# EAGLE design rekickNewGeneration005 (EAGLE 5.10)

## Sheet 1 of 4
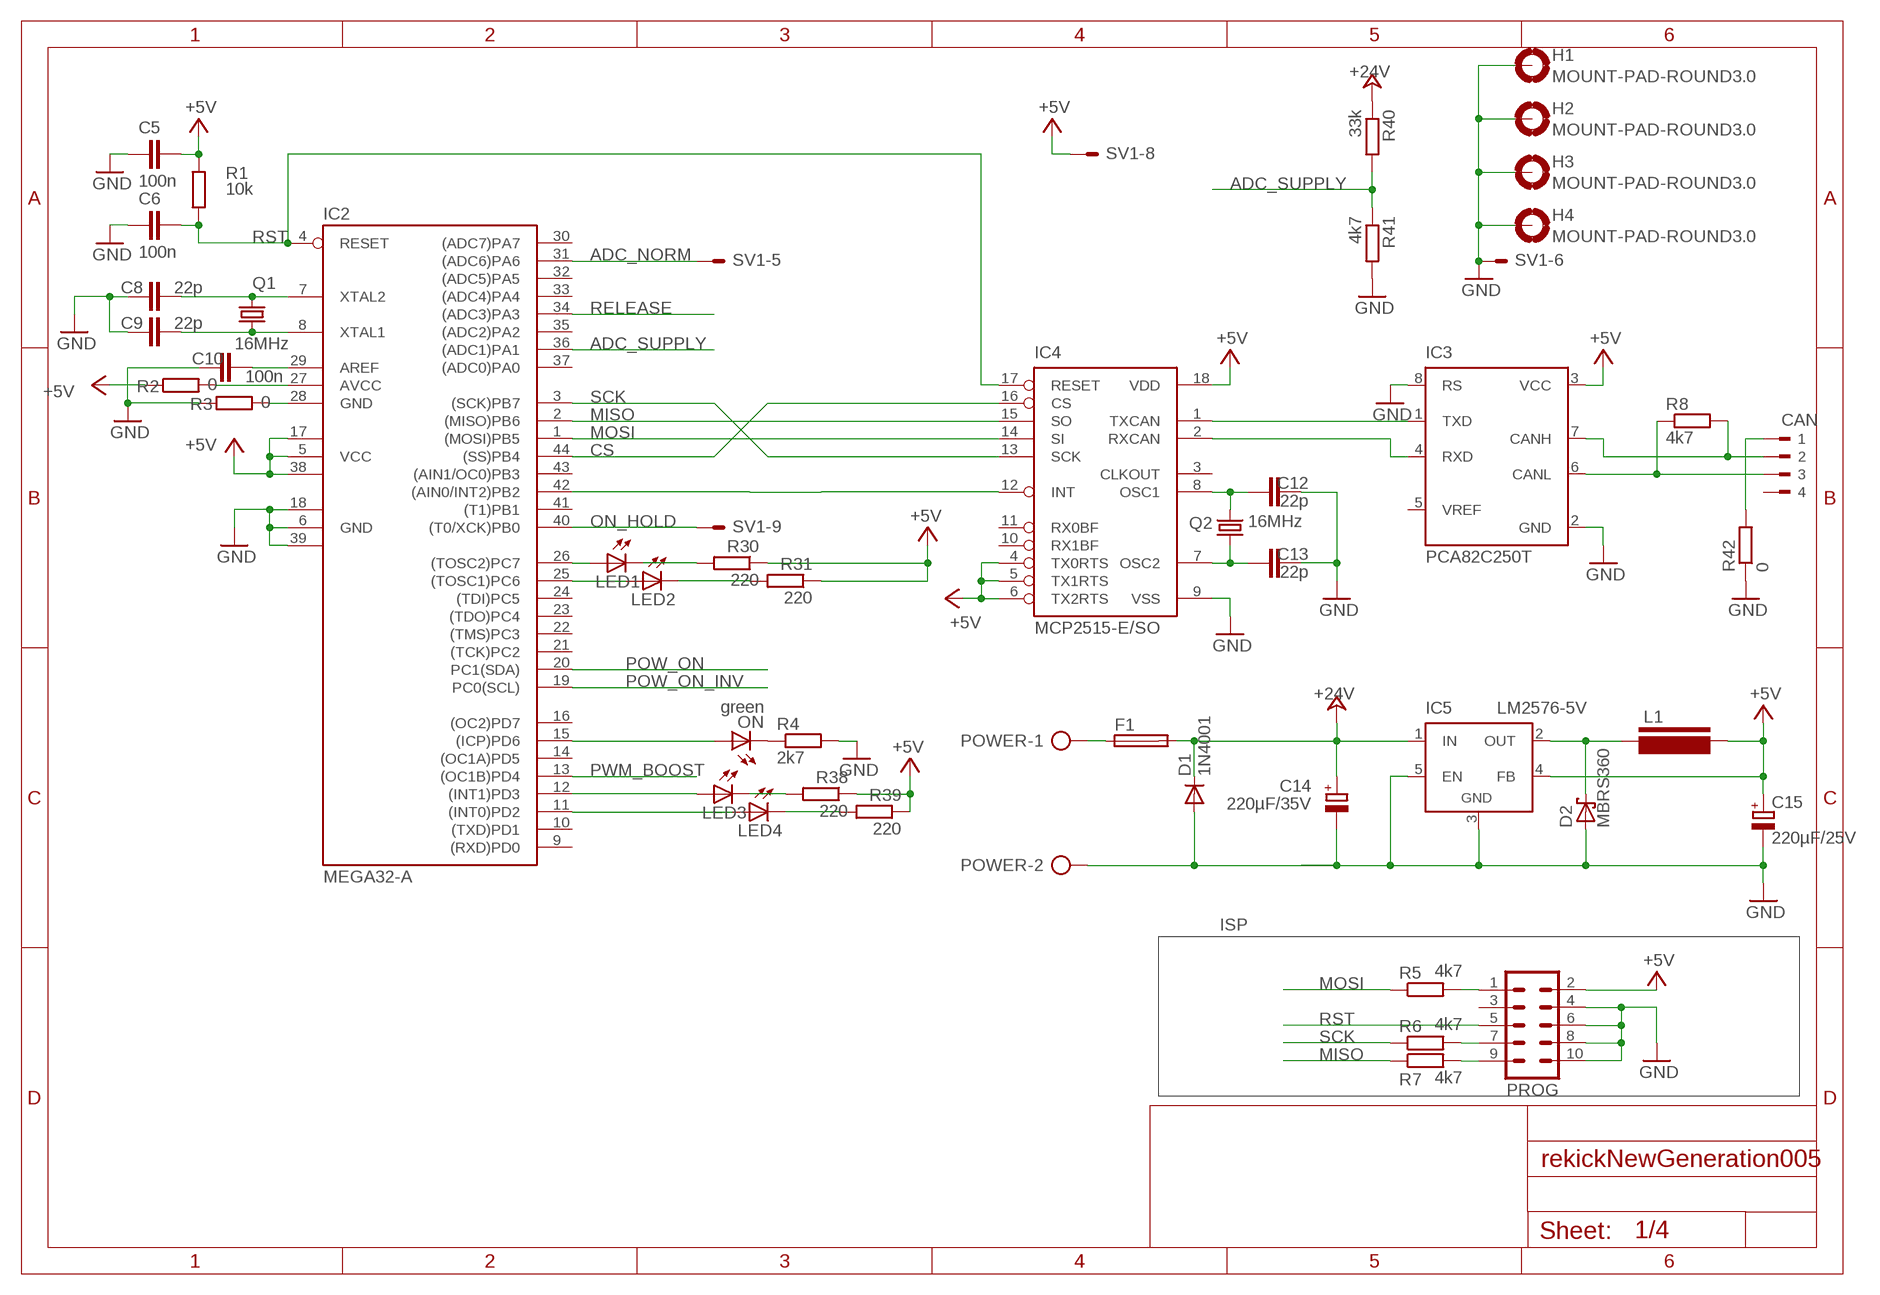
[diagram p0: schematic, sheet 1]

### Parts
C5  100n  C-EUC0603  [C0603]
C6  100n  C-EUC0603  [C0603]
C8  22p  C-EUC0603  [C0603]
C9  22p  C-EUC0603  [C0603]
C10  100n  C-EUC0603  [C0603]
C12  22p  C-EUC0603  [C0603]
C13  22p  C-EUC0603  [C0603]
C14  220µF/35V  CPOL-EUE5-10.5  [E5-10,5]
C15  220µF/25V  CPOL-EUE3.5-10  [E3,5-10]
CAN  90-4  [90-4]
D1  1N4001  1N4004  [DO41-10]
D2  MBRS360  SCHOTTKY-DIODESMC  [SMC]
F1  SH22,5A  [SH22,5A]
H1  MOUNT-PAD-ROUND3.0  [3,0-PAD]
H2  MOUNT-PAD-ROUND3.0  [3,0-PAD]
H3  MOUNT-PAD-ROUND3.0  [3,0-PAD]
H4  MOUNT-PAD-ROUND3.0  [3,0-PAD]
IC2  MEGA32-A  [TQFP44]
IC3  PCA82C250T  [SO8]
IC4  MCP2515-E/SO  [SO18L]
IC5  LM2576-5V  LM2596TV  [TO220-51]
L1  L-PISR  [PISR]
LED1  LEDCHIP-LED0805  [CHIP-LED0805]
LED2  LEDCHIP-LED0805  [CHIP-LED0805]
LED3  LEDCHIP-LED0805  [CHIP-LED0805]
LED4  LEDCHIP-LED0805  [CHIP-LED0805]
ON  green  LED3MM  [LED3MM]
POWER  AK500/2-H  [AK500/2-H]
PROG  ML10  [ML10]
Q1  16MHz  CRYSTALHC49S  [HC49/S]
Q2  16MHz  CRYSTALHC49U-V  [HC49U-V]
R1  10k  R-EU_R0805  [R0805]
R2  0  R-EU_R0805  [R0805]
R3  0  R-EU_R0805  [R0805]
R4  2k7  R-EU_R0805  [R0805]
R5  4k7  R-EU_R0805  [R0805]
R6  4k7  R-EU_R0805  [R0805]
R7  4k7  R-EU_R0805  [R0805]
R8  4k7  R-EU_R0805  [R0805]
R30  220  R-EU_R0805  [R0805]
R31  220  R-EU_R0805  [R0805]
R38  220  R-EU_R0805  [R0805]
R39  220  R-EU_R0805  [R0805]
R40  33k  R-EU_R0805  [R0805]
R41  4k7  R-EU_R0805  [R0805]
R42  0  R-EU_R0805  [R0805]
SV1  ML10E  [ML10]

### Nets
+5V [Power]: C5.2 C15.+ IC2.5(VCC) IC2.17(VCC1) IC2.38(VCC2) IC3.3(VCC) IC4.4(TX0RTS) IC4.5(TX1RTS) IC4.6(TX2RTS) IC4.18(VDD) IC5.4(FB) L1.P$2 PROG.2 R1.2 R2.1 R30.1 R31.1 R38.1 R39.1 SV1.8 ; also sheet 2
+24V [Power]: C14.+ D1.C F1.2 IC5.1(IN) R40.1 ; also sheet 2
ADC_NORM: IC2.31((ADC6)PA6) SV1.5
ADC_SUPPLY: IC2.36((ADC1)PA1) R40.2 R41.1
CS: IC2.44((SS)PB4) IC4.16(CS)
GND [Power]: C5.1 C6.1 C8.1 C9.2 C10.1 C12.2 C13.2 C14.- C15.- D1.A D2.A H1.B3,0(MOUNT) H2.B3,0(MOUNT) H3.B3,0(MOUNT) H4.B3,0(MOUNT) IC2.6(GND) IC2.18(GND1) IC2.39(GND2) IC3.2(GND) IC3.8(RS) IC4.9(VSS) IC5.3(GND) IC5.5(EN) POWER.2 PROG.4 PROG.6 PROG.8 PROG.10 R3.1 R4.2 R41.2 R42.1 SV1.6 ; also sheet 2
MISO: IC2.2((MISO)PB6) IC4.15(SO) R7.1
MOSI: IC2.1((MOSI)PB5) IC4.14(SI) R5.1
N$1: IC2.15((ICP)PD6) ON.A
N$2: C10.2 IC2.29(AREF)
N$3: IC2.27(AVCC) R2.2
N$4: C9.1 IC2.8(XTAL1) Q1.1
N$5: C8.2 IC2.7(XTAL2) Q1.2
N$6: PROG.1 R5.2
N$7: IC2.28(GND) R3.2
N$8: PROG.7 R6.2
N$9: PROG.9 R7.2
N$22: IC3.4(RXD) IC4.2(RXCAN)
N$24: CAN.3 IC3.6(CANL) R8.1
N$30 [Power]: D2.C IC5.2(OUT) L1.P$1
N$31: ON.K(C) R4.1
N$42: IC2.42((AIN0/INT2)PB2) IC4.12(INT)
N$43 [Power]: F1.1 POWER.1
N$44: LED2.C R31.2
N$45: LED1.C R30.2
N$46: CAN.1 R42.2
N$48: IC2.26((TOSC2)PC7) LED1.A
N$49: IC2.25((TOSC1)PC6) LED2.A
N$53: C13.1 IC4.7(OSC2) Q2.1
N$54: C12.1 IC4.8(OSC1) Q2.2
N$58: LED3.C R38.2
N$59: CAN.2 IC3.7(CANH) R8.2
N$60: LED4.C R39.2
N$61: IC2.12((INT1)PD3) LED3.A
N$62: IC2.11((INT0)PD2) LED4.A
ON_HOLD: IC2.40((T0/XCK)PB0) SV1.9
PIN1: IC3.1(TXD) IC4.1(TXCAN)
POW_ON: IC2.20(PC1(SDA)) ; also sheet 2
POW_ON_INV: IC2.19(PC0(SCL)) ; also sheet 2
PWM_BOOST: IC2.13((OC1B)PD4) ; also sheet 2
RELEASE: IC2.34((ADC3)PA3) ; also sheet 2
RST: C6.2 IC2.4(RESET) IC4.17(RESET) PROG.5 R1.1 ; also sheet 2
SCK: IC2.3((SCK)PB7) IC4.13(SCK) R6.1
Unconnected: CAN.4 IC2.9((RXD)PD0) IC2.10((TXD)PD1) IC2.14((OC1A)PD5) IC2.16((OC2)PD7) IC2.21((TCK)PC2) IC2.22((TMS)PC3) IC2.23((TDO)PC4) IC2.24((TDI)PC5) IC2.30((ADC7)PA7) IC2.32((ADC5)PA5) IC2.33((ADC4)PA4) IC2.35((ADC2)PA2) IC2.37((ADC0)PA0) IC2.41((T1)PB1) IC2.43((AIN1/OC0)PB3) IC3.5(VREF) IC4.3(CLKOUT) IC4.10(RX1BF) IC4.11(RX0BF) PROG.3 SV1.3 SV1.10

### Notes on the sheet
- ISP

## Sheet 2 of 4
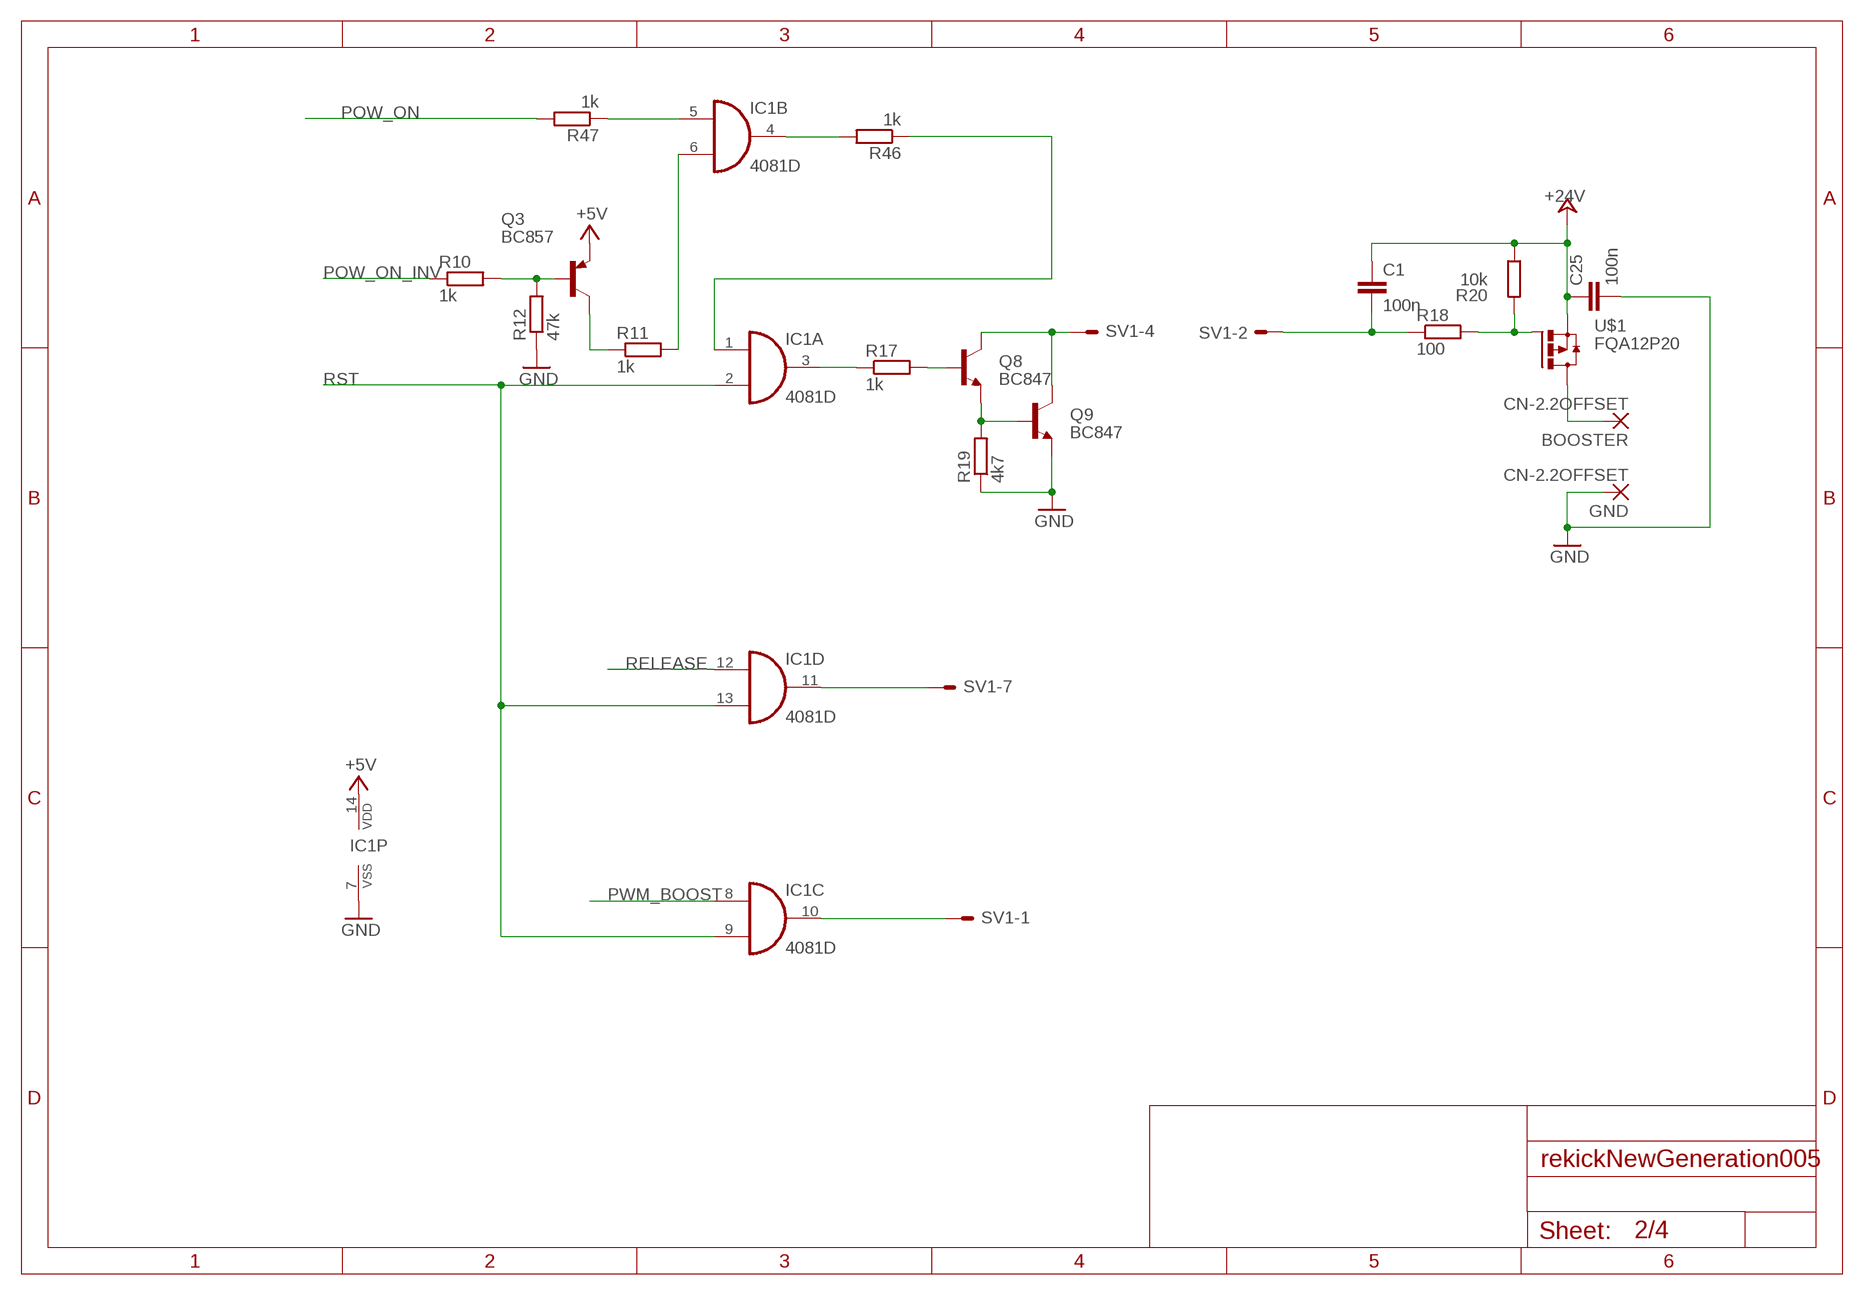
[diagram p1: schematic, sheet 2]

### Parts
BOOSTER  CN-2.2OFFSET  [CN-2,1]
C1  100n  C-EUC0603  [C0603]
C25  100n  C-EUC0603  [C0603]
GND  CN-2.2OFFSET  [CN-2,1]
IC1  4081D  [SO14]
Q3  BC857  BC857ASMD  [SOT23-BEC]
Q8  BC847  BC817-25SMD  [SOT23-BEC]
Q9  BC847  BC817-25SMD  [SOT23-BEC]
R10  1k  R-EU_R0805  [R0805]
R11  1k  R-EU_R0805  [R0805]
R12  47k  R-EU_R0805  [R0805]
R17  1k  R-EU_R0805  [R0805]
R18  100  R-EU_R0805  [R0805]
R19  4k7  R-EU_R0805  [R0805]
R20  10k  R-EU_R0805  [R0805]
R46  1k  R-EU_R0805  [R0805]
R47  1k  R-EU_R0805  [R0805]
U$1  FQA12P20  [TO247BV]

### Nets
+5V [Power]: IC1.14(P:VDD) Q3.E ; also sheet 1
+24V [Power]: C1.1 C25.1 R20.1 U$1.S ; also sheet 1
GND [Power]: C25.2 GND.>NAME(P) IC1.7(P:VSS) Q9.E R12.1 R19.1 ; also sheet 1
N$10 [Power]: Q8.C Q9.C SV1.4
N$13: Q8.E Q9.B R19.2
N$20: C1.2 R18.1 SV1.2
N$21: Q8.B R17.2
N$26: R18.2 R20.2 U$1.G
N$28: Q3.B R10.2 R12.2
N$29: IC1.11(D:O) SV1.7
N$32: Q3.C R11.1
N$33: IC1.6(B:I1) R11.2
N$36: IC1.10(C:O) SV1.1
N$40: IC1.3(A:O) R17.1
N$41: BOOSTER.>NAME(P) U$1.D
N$50: IC1.4(B:O) R46.2
N$65: IC1.1(A:I0) R46.1
N$67: IC1.5(B:I0) R47.1
POW_ON: R47.2 ; also sheet 1
POW_ON_INV: R10.1 ; also sheet 1
PWM_BOOST: IC1.8(C:I0) ; also sheet 1
RELEASE: IC1.12(D:I0) ; also sheet 1
RST: IC1.2(A:I1) IC1.9(C:I1) IC1.13(D:I1) ; also sheet 1

## Sheet 3 of 4
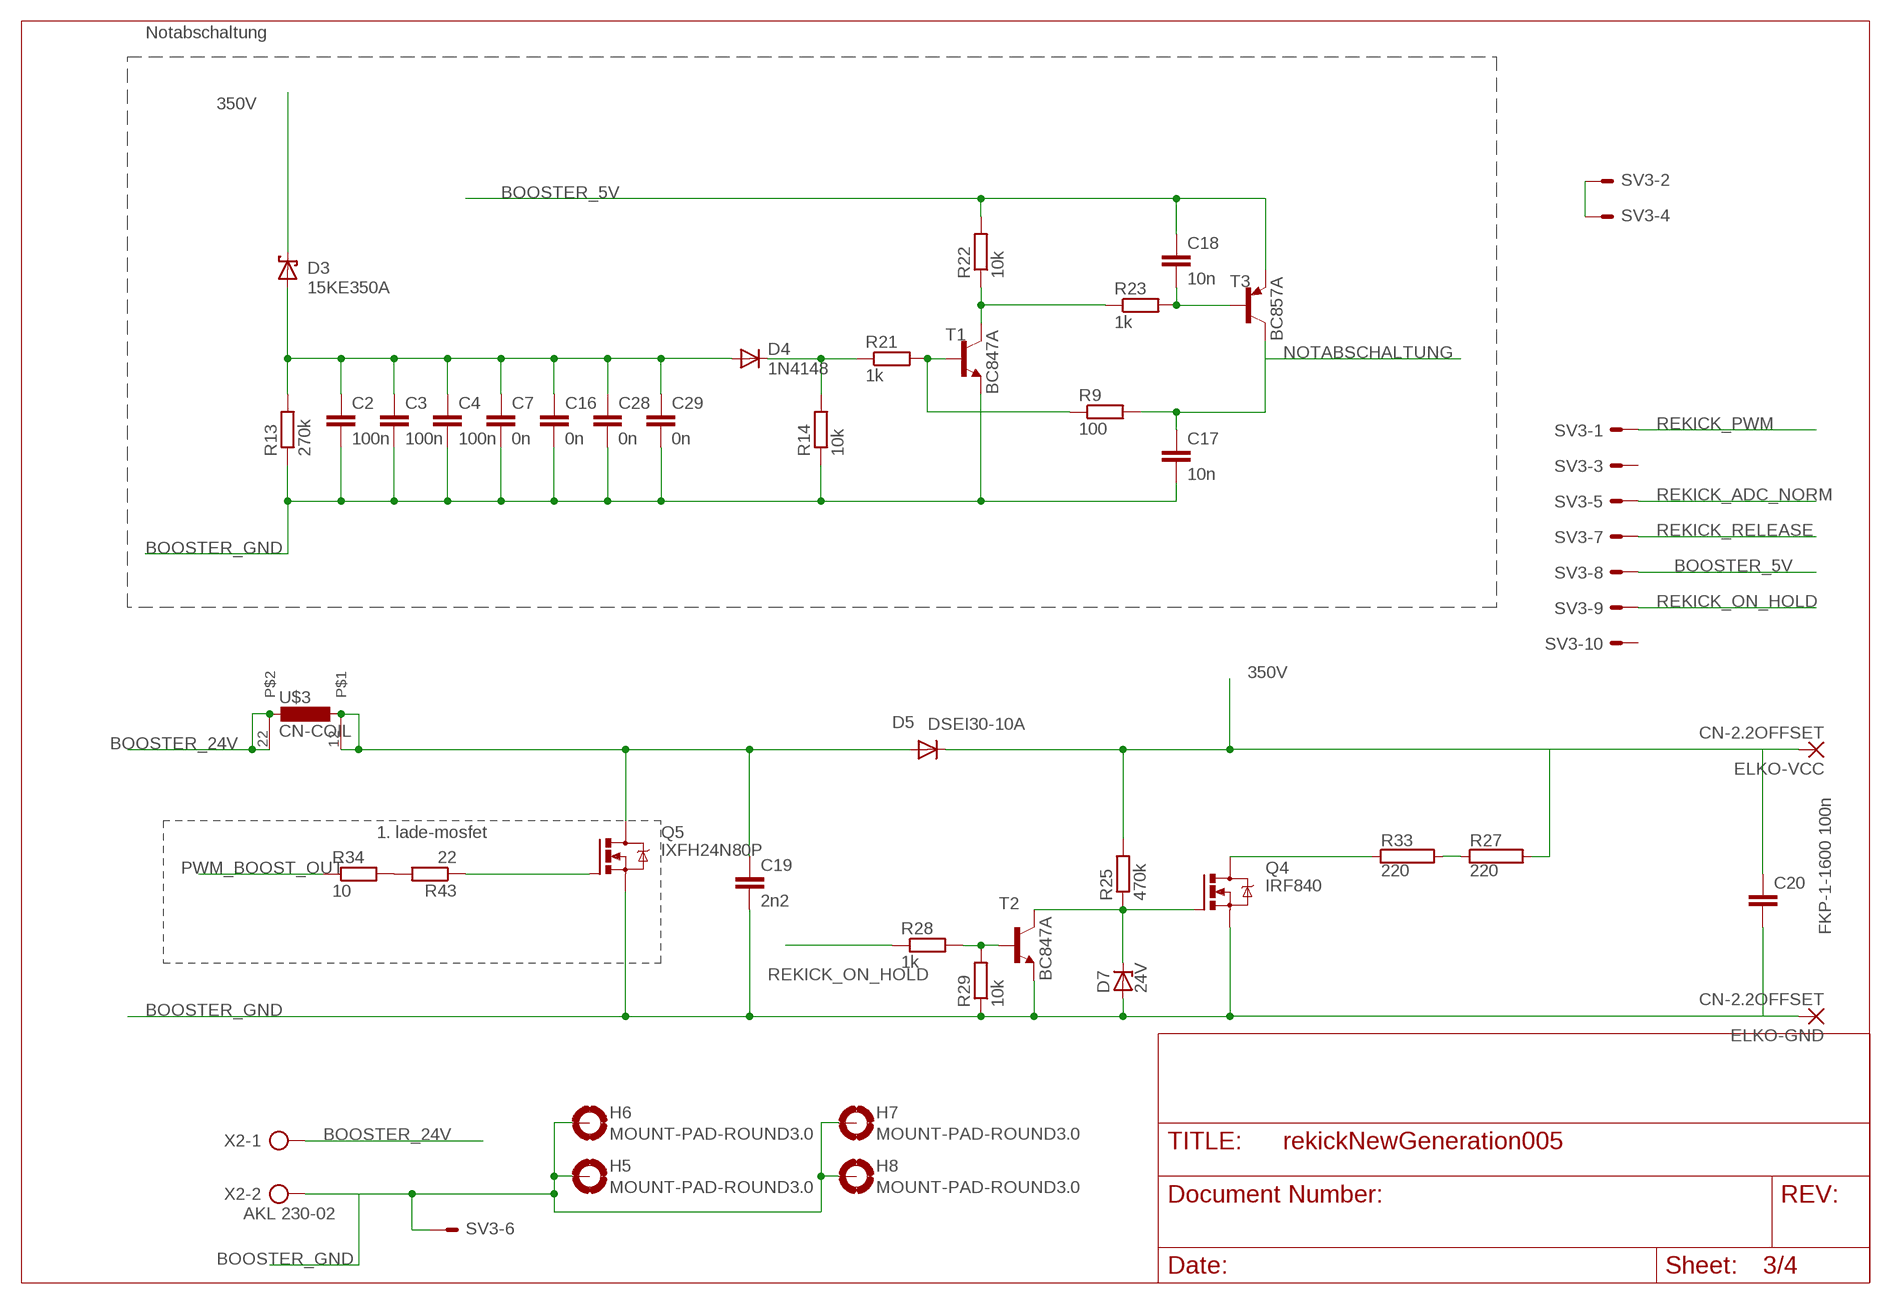
[diagram p2: schematic, sheet 3]

### Parts
C2  100n  C-EUC0603  [C0603]
C3  100n  C-EUC0603  [C0603]
C4  100n  C-EUC0603  [C0603]
C7  0n  C-EUC0603  [C0603]
C16  0n  C-EUC0603  [C0603]
C17  10n  C-EUC0603  [C0603]
C18  10n  C-EUC0603  [C0603]
C19  2n2  C-EU150-054X183  [C150-054X183]
C20  FKP-1-1600 100n  C-EU375-192X418  [C375-192X418]
C28  0n  C-EUC0603  [C0603]
C29  0n  C-EUC0603  [C0603]
D3  15KE350A  15KEXX  [CB429-17]
D4  1N4148  [DO35-10]
D5  DSEI30-10A  DEIS10-30A  [TO247AD]
D7  24V  ZENER-DIODEDO35Z10  [DO35Z10]
ELKO-GND  CN-2.2OFFSET  [CN-2,1]
ELKO-VCC  CN-2.2OFFSET  [CN-2,1]
H5  MOUNT-PAD-ROUND3.0  [3,0-PAD]
H6  MOUNT-PAD-ROUND3.0  [3,0-PAD]
H7  MOUNT-PAD-ROUND3.0  [3,0-PAD]
H8  MOUNT-PAD-ROUND3.0  [3,0-PAD]
Q4  IRF840  IRF740  [TO220BV]
Q5  IXFH24N80P  IRFPC40  [TO247BV]
R9  100  R-EU_R0805  [R0805]
R13  270k  R-EU_R0805  [R0805]
R14  10k  R-EU_R0805  [R0805]
R21  1k  R-EU_R0805  [R0805]
R22  10k  R-EU_R0805  [R0805]
R23  1k  R-EU_R0805  [R0805]
R25  470k  R-EU_R0805  [R0805]
R27  220  RHS25  [HS25]
R28  1k  R-EU_R0805  [R0805]
R29  10k  R-EU_R0805  [R0805]
R33  220  RHS25  [HS25]
R34  10  R-EU_R0805  [R0805]
R43  22  R-EU_R0805  [R0805]
SV3  ML10E  [ML10]
T1  BC847A  BC817-25-NPN-SOT23-BEC  [SOT23-BEC]
T2  BC847A  BC817-25-NPN-SOT23-BEC  [SOT23-BEC]
T3  BC857A  BC807-25-PNP-SOT23-BEC  [SOT23-BEC]
U$3  CN-COIL  [CN-TJ6-U1-2]
X2  AKL 230-02  AK500/2  [AK500/2]

### Nets
350V: C20.1 D3.C D5.K(C) ELKO-VCC.>NAME(P) R25.2 R27.2 ; also sheet 4
BOOSTER_5V: C18.1 R22.2 SV3.8 T3.E
BOOSTER_24V [Power]: U$3.21 U$3.22 X2.1 ; also sheet 4
BOOSTER_GND [Power]: C2.2 C3.2 C4.2 C7.2 C16.2 C17.2 C19.2 C20.2 C28.2 C29.2 D7.A ELKO-GND.>NAME(P) H5.B3,0(MOUNT) H6.B3,0(MOUNT) H7.B3,0(MOUNT) H8.B3,0(MOUNT) Q4.S Q5.S R13.1 R14.1 R29.1 SV3.6 T1.E T2.E X2.2 ; also sheet 4
N$15: C2.1 C3.1 C4.1 C7.1 C16.1 C28.1 C29.1 D3.A D4.A R13.2
N$27: C18.2 R23.2 T3.B
N$34: R9.1 R21.2 T1.B
N$35 [Power]: C19.1 D5.A Q5.D U$3.11 U$3.12
N$37: D7.C Q4.G R25.1 T2.C
N$38: R28.2 R29.2 T2.B
N$47: R34.2 R43.2
N$51: Q5.G R43.1
N$52: D4.C R14.2 R21.1
N$56: Q4.D R33.1
N$57: R27.1 R33.2
N$66: SV3.2 SV3.4
N$101: R22.1 R23.1 T1.C
NOTABSCHALTUNG: C17.1 R9.2 T3.C ; also sheet 4
PWM_BOOST_OUT: R34.1 ; also sheet 4
REKICK_ADC_NORM: SV3.5 ; also sheet 4
REKICK_ON_HOLD: R28.1 SV3.9
REKICK_PWM: SV3.1 ; also sheet 4
REKICK_RELEASE: SV3.7 ; also sheet 4
Unconnected: SV3.3 SV3.10

### Notes on the sheet
- Notabschaltung
- 1. lade-mosfet

## Sheet 4 of 4
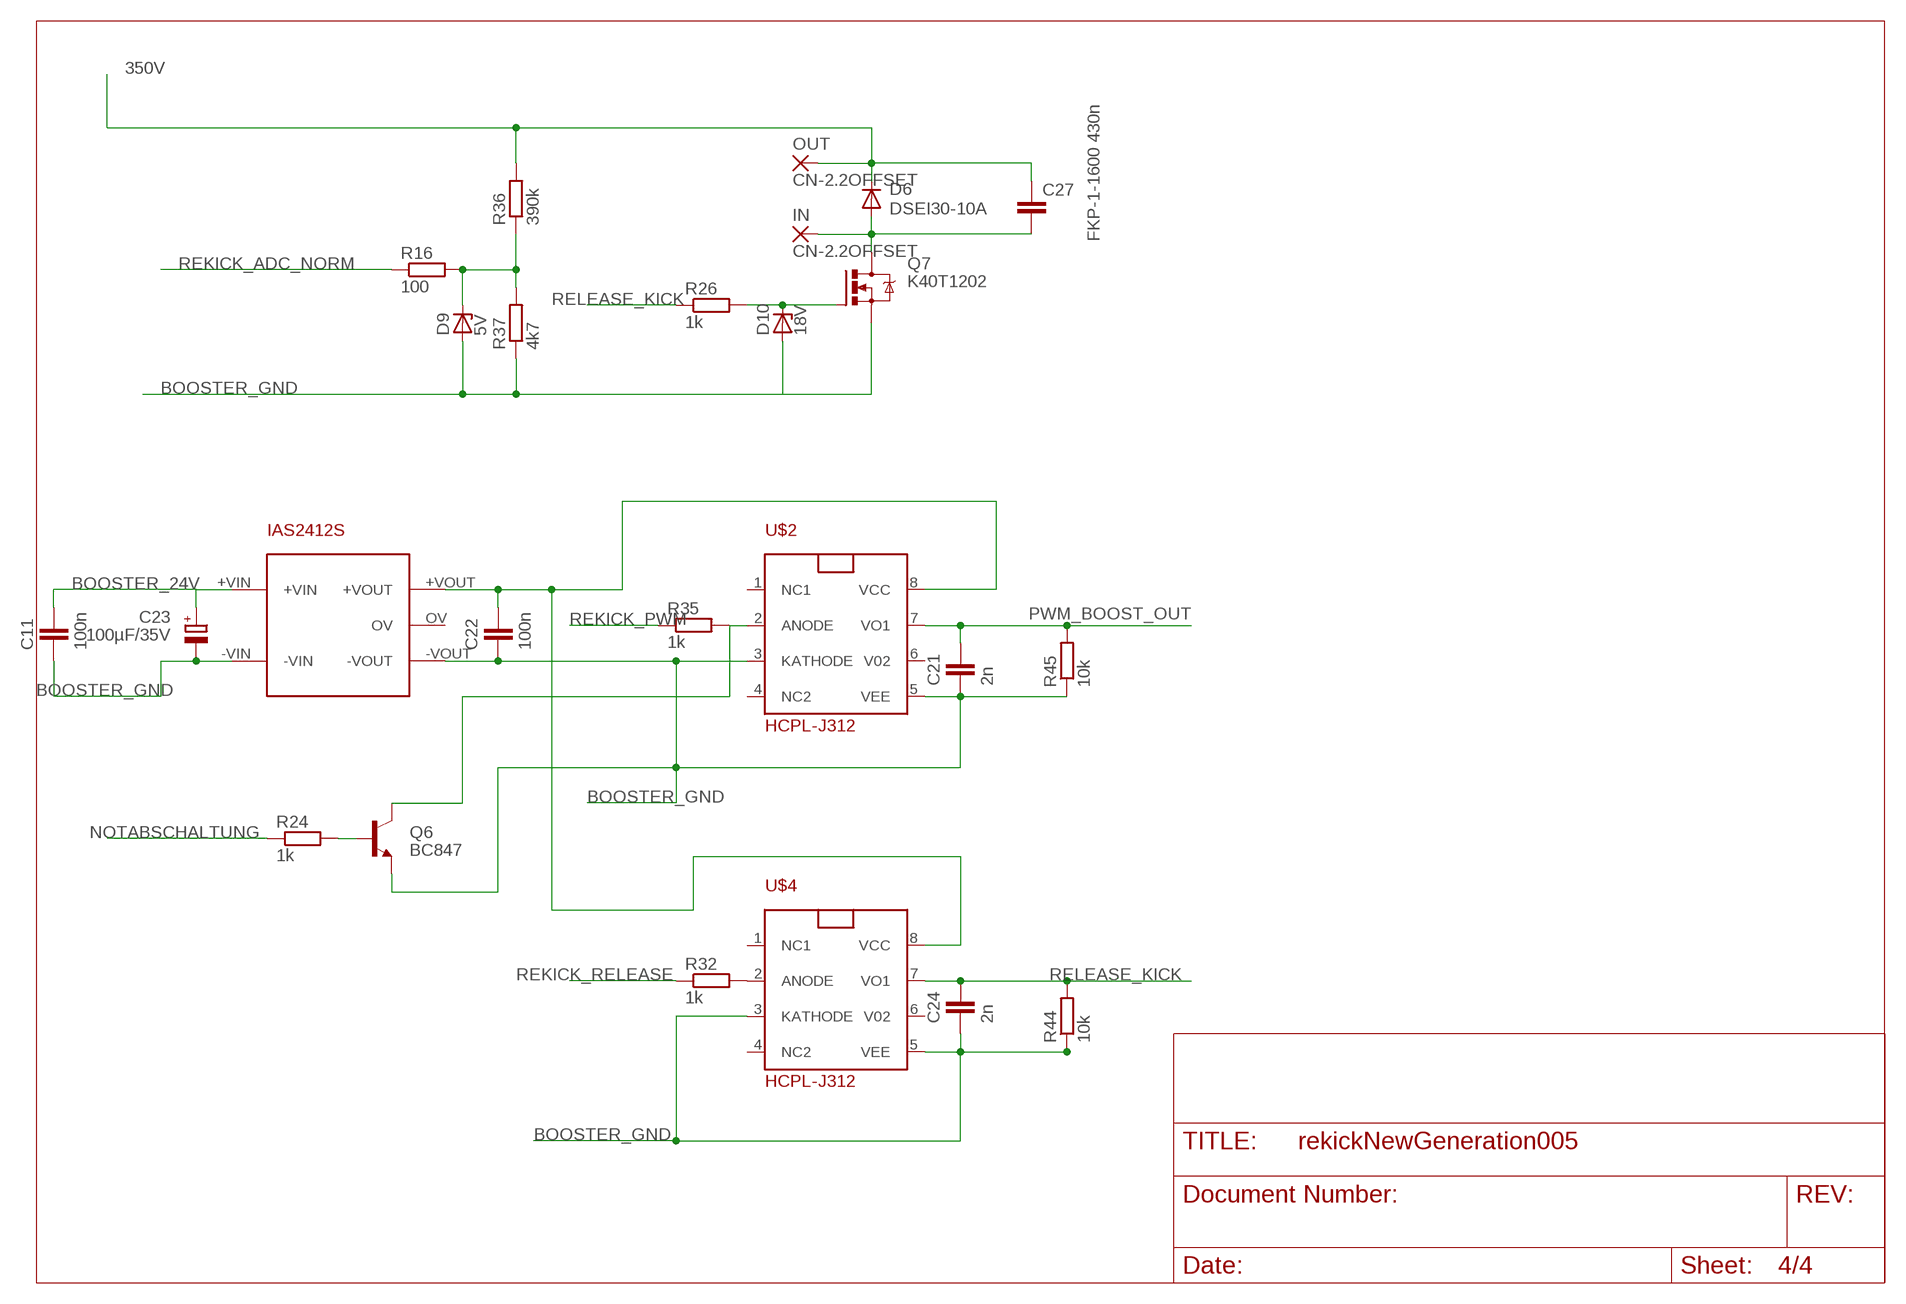
[diagram p3: schematic, sheet 4]

### Parts
C11  100n  C-EUC0603  [C0603]
C21  2n  C-EUC0603  [C0603]
C22  100n  C-EUC0603  [C0603]
C23  100µF/35V  CPOL-EUE5-10.5  [E5-10,5]
C24  2n  C-EUC0603  [C0603]
C27  FKP-1-1600 430n  C-EU375-192X418  [C375-192X418]
D6  DSEI30-10A  DEIS10-30A  [TO247AD]
D9  5V  ZENER-DIODESOT23  [SOT23]
D10  18V  ZENER-DIODEDO35Z10  [DO35Z10]
IN  CN-2.2OFFSET  [CN-2,1]
OUT  CN-2.2OFFSET  [CN-2,1]
Q6  BC847  BC817-25SMD  [SOT23-BEC]
Q7  K40T1202  IRFPC40  [TO247BV]
R16  100  R-EU_R0805  [R0805]
R24  1k  R-EU_R0805  [R0805]
R26  1k  R-EU_R0805  [R0805]
R32  1k  R-EU_R0805  [R0805]
R35  1k  R-EU_R0805  [R0805]
R36  390k  R-EU_0207/15  [0207/15]
R37  4k7  R-EU_0207/15  [0207/15]
R44  10k  R-EU_R0805  [R0805]
R45  10k  R-EU_R0805  [R0805]
U$2  HCPL-J312  [DIL08]
U$4  HCPL-J312  [DIL08]
U$5  IA2412S  [SIP]

### Nets
350V: C27.1 D6.K(C) OUT.>NAME(P) R36.2 ; also sheet 3
ADC_250V1: D9.3(C) R16.2 R36.1 R37.2
BOOSTER_24V [Power]: C11.2 C23.+ U$5.+VIN ; also sheet 3
BOOSTER_GND [Power]: C11.1 C21.1 C22.1 C23.- C24.1 D9.1(A) D10.A Q6.E Q7.S R37.1 R44.1 R45.1 U$2.3(KATHODE) U$2.5(VEE) U$4.3(KATHODE) U$4.5(VEE) U$5.-VIN U$5.-VOUT ; also sheet 3
BOSTER_24V: C27.2 D6.A IN.>NAME(P) Q7.D
N$55: D10.C Q7.G R26.2
N$68: R32.2 U$4.2(ANODE)
N$69 [Power]: Q6.C R35.2 U$2.2(ANODE)
N$70: C22.2 U$2.8(VCC) U$4.8(VCC) U$5.+VOUT
N$73: Q6.B R24.2
NOTABSCHALTUNG: R24.1 ; also sheet 3
PWM_BOOST_OUT: C21.2 R45.2 U$2.7(VO1) ; also sheet 3
REKICK_ADC_NORM: R16.1 ; also sheet 3
REKICK_PWM: R35.1 ; also sheet 3
REKICK_RELEASE: R32.1 ; also sheet 3
RELEASE_KICK: C24.2 R26.1 R44.2 U$4.7(VO1)
Unconnected: U$2.1(NC1) U$2.4(NC2) U$2.6(V02) U$4.1(NC1) U$4.4(NC2) U$4.6(V02) U$5.OV

## Library data of the parts
BOOSTER ELKO-GND ELKO-VCC GND IN OUT = mywirepad:CN-2.2OFFSET
C1-C13 C16-C22 C24 C25 C27-C29 = rcl:C-EU: CAPACITOR, European symbol
C14 C15 C23 = rcl:CPOL-EU: POLARIZED CAPACITOR, European symbol
CAN = con-weidmueller-sl35:90-4: WEIDMUELLER CLAMP CONNECTOR
D1 = diode:1N4004: DIODE general purpose rectifier, 1 A
D2 = diode:SCHOTTKY-DIODE: Schottky Diode
D3 = diode:15KEXX: DIODE
D4 = diode:1N4148: DIODE high speed (Philips)
D5 D6 = carpenoctem:DEIS10-30A
D7 D9 D10 = diode:ZENER-DIODE: Z-Diode
F1 = fuse:SH22,5A: FUSE HOLDER grid 22,5mm, isolated cap OGN0031 8201, Schurter (Buerklin)
H1-H8 = holes:MOUNT-PAD-ROUND: MOUNTING PAD, round
IC1 = 40xx:4081: Quad 2-input AND
IC2 = atmel:MEGA32: MICROCONTROLLER 32 Kbytes FLASH 2 Kbytes SRAM 1 Kbytes EEPROM USART 8-channel 10 bit ADC Source: www.atmel.com .. doc2503.pdf
IC3 = micro-philips:PCA82C250: CAN CONTROLLER INTERFACE
IC4 = mcp2515:MCP2515
IC5 = linear:LM2596T: STEP-DOWN VOLTAGE REGULATOR
L1 = L-PISR:L-PISR: Fastron SMD Power Inductors (also Shielded) - PISR Series Data Sheet <http://www.fastrongroup.com/products/inductors/pdf/PISR.pdf> Part No Inductance L (µH) fL (MHz) Tol ± (%) SRF min (MHz) DCR max (Ω) Rated DC Current | sat (A) | Δ T = 40°C (A) PISR-1R0M-04 1.0 0.1 20 164 0.009 21 8.60 PISR-2R2M-04 2.2 0.1 20 95 0.014 16 7.10 PISR-3R3M-04 3.3 0.1 20 72 0.017 15 6.40 PISR-4R7M-04 4.7 0.1 20 52 0.019 13 5.80 PISR-5R6M-04 5.6 0.1 20 41 0.022 12 5.50 PISR-6R8M-04 6.8 0.1 20 35 0.024 11 5.20 PISR-100M-04 10 0.1 20 24 0.029 10 4.50 PISR-150M-04 15 0.1 20 20 0.035 8.0 4.10 PISR-220M-04 22 0.1 20 15 0.04 7.0 3.60 PISR-330M-04 33 0.1 20 10 0.06 5.6 3.10 PISR-470M-04 47 0.1 20 8 0.07 4.6 2.70 PISR-680M-04 68 0.1 20 6.5 0.10 3.6 2.30 PISR-101M-04 100 0.1 20 5.2 0.17 3.1 1.90 PISR-151M-04 150 0.1 20 4.2 0.22 2.6 1.60 PISR-221M-04 220 0.1 20 3.3 0.34 2.2 1.30 PISR-331M-04 330 0.1 20 2.7 0.52 1.9 1.10 PISR-471M-04 470 0.1 20 2.1 0.76 1.4 0.85 PISR-681M-04 680 0.1 20 1.8 1.1 1.2 0.74 PISR-102M-04 1000 0.1 20 1.3 1.7 1.0 0.57
LED1-LED4 ON = led:LED: LED OSRAM: - CHIPLED LG R971, LG N971, LY N971, LG Q971, LY Q971, LO R971, LY R971 LH N974, LH R974 LS Q976, LO Q976, LY Q976 LO Q996 - Hyper CHIPLED LW Q18S LB Q993, LB Q99A, LB R99A - SideLED LS A670, LO A670, LY A670, LG A670, LP A670 LB A673, LV A673, LT A673, LW A673 LH A674 LY A675 LS A676, LA A676, LO A676, LY A676, LW A676 LS A679, LY A679, LG A679 - Hyper Micro SIDELED® LS Y876, LA Y876, LO Y876, LY Y876 LT Y87S - SmartLED LW L88C, LW L88S LB L89C, LB L89S, LG L890 LS L89K, LO L89K, LY L89K LS L896, LA L896, LO L896, LY L896 - TOPLED LS T670, LO T670, LY T670, LG T670, LP T670 LSG T670, LSP T670, LSY T670, LOP T670, LYG T670 LG T671, LOG T671, LSG T671 LB T673, LV T673, LT T673, LW T673 LH T674 LS T676, LA T676, LO T676, LY T676, LB T676, LH T676, LSB T676, LW T676 LB T67C, LV T67C, LT T67C, LS T67K, LO T67K, LY T67K, LW E67C LS E67B, LA E67B, LO E67B, LY E67B, LB E67C, LV E67C, LT E67C LW T67C LS T679, LY T679, LG T679 LS T770, LO T770, LY T770, LG T770, LP T770 LB T773, LV T773, LT T773, LW T773 LH T774 LS E675, LA E675, LY E675, LS T675 LS T776, LA T776, LO T776, LY T776, LB T776 LHGB T686 LT T68C, LB T68C - Hyper Mini TOPLED® LB M676 - Mini TOPLED Santana® LG M470 LS M47K, LO M47K, LY M47K Source: http://www.osram.convergy.de LUXEON: - LUMILED® LXK2-PW12-R00, LXK2-PW12-S00, LXK2-PW14-U00, LXK2-PW14-V00 LXK2-PM12-R00, LXK2-PM12-S00, LXK2-PM14-U00 LXK2-PE12-Q00, LXK2-PE12-R00, LXK2-PE12-S00, LXK2-PE14-T00, LXK2-PE14-U00 LXK2-PB12-K00, LXK2-PB12-L00, LXK2-PB12-M00, LXK2-PB14-N00, LXK2-PB14-P00, LXK2-PB14-Q00 LXK2-PR12-L00, LXK2-PR12-M00, LXK2-PR14-Q00, LXK2-PR14-R00 LXK2-PD12-Q00, LXK2-PD12-R00, LXK2-PD12-S00 LXK2-PH12-R00, LXK2-PH12-S00 LXK2-PL12-P00, LXK2-PL12-Q00, LXK2-PL12-R00 Source: www.luxeon.com KINGBRIGHT: KA-3528ASYC Source: www.kingbright.com
POWER = con-ptr500:AK500/2-H: CONNECTOR Aug. 2004 / PTR Meßtechnik: Die Bezeichnung der Serie AK505 wurde geändert. Es handelt sich hierbei um AK500 in horizontaler Ausführung.
PROG = con-harting-ml:ML10: HARTING
Q1 Q2 = crystal:CRYSTAL: CRYSTAL
Q3 = transistor-pnp:BC857*: PNP Transistror
Q4 = transistor-power:IRF740: N-CHANNEL MOS FET
Q5 Q7 = transistor-power:IRFPC40: N-CHANNEL MOS FET
Q6 Q8 Q9 = transistor-npn:BC817*: NPN Transistor
R1-R14 R16-R26 R28-R32 R34-R47 = rcl:R-EU_: RESISTOR, European symbol
R27 R33 = resistor-power:R: Power Resitor
SV1 SV3 = con-harting-ml:ML10?E: HARTING
T1 T2 = transistor:*-NPN-: NPN Transistror
T3 = transistor:*-PNP-: PNP Transistror
U$1 = carpenoctem:FQA12P20
U$2 U$4 = rekickNewGeneration:HCPL-J312
U$3 = myrcl:CN-COIL
U$5 = rekickNewGeneration:IA2412S
X2 = con-ptr500:AK500/2: CONNECTOR

## Net classes
1 Power: width 0.406 mm
2 High Power: width 2 mm

## Board
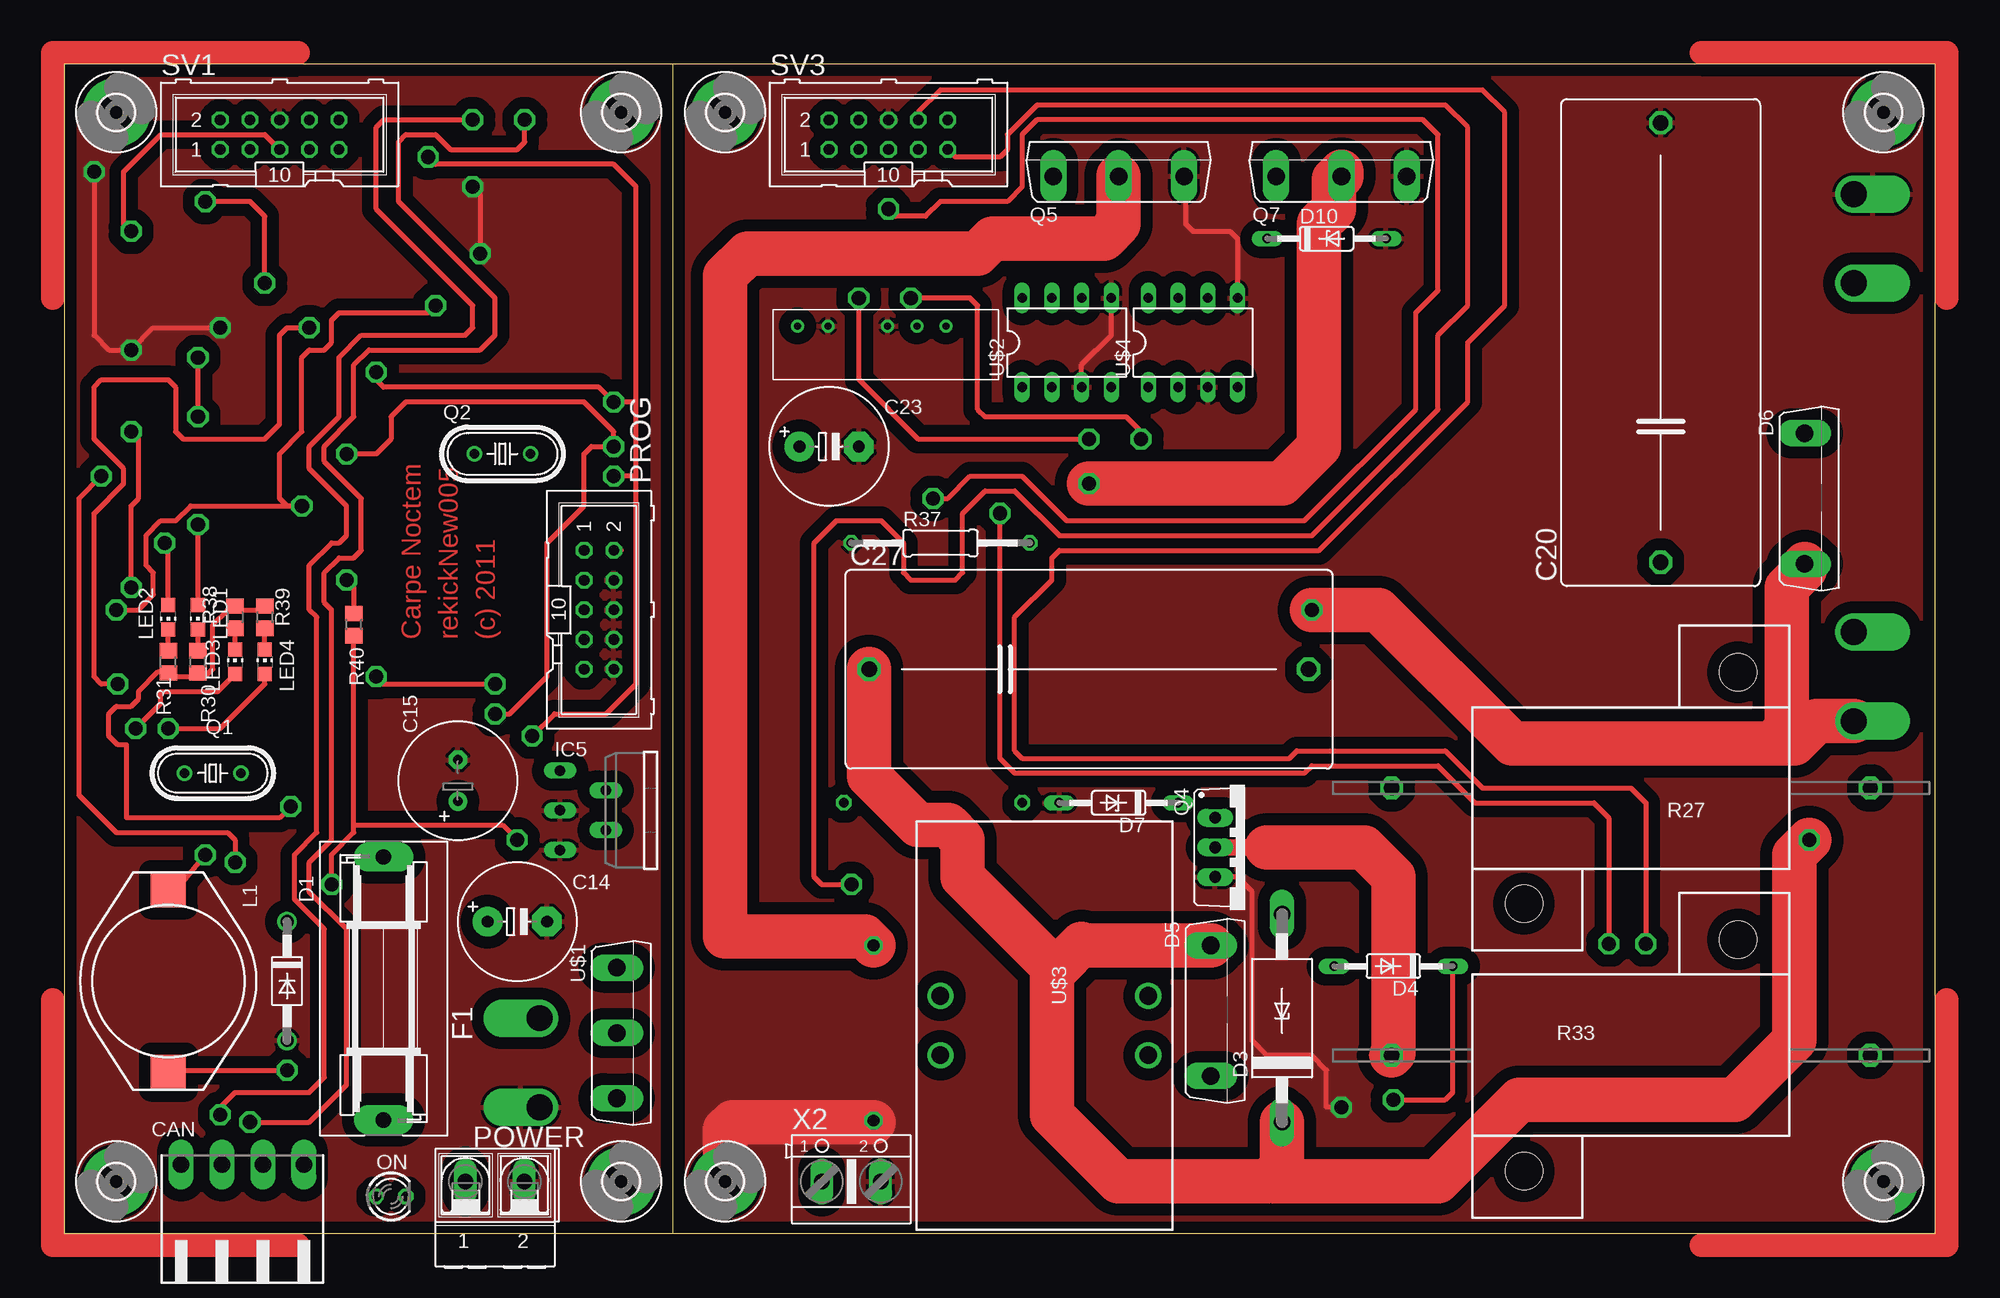
[diagram p4: board, top side]
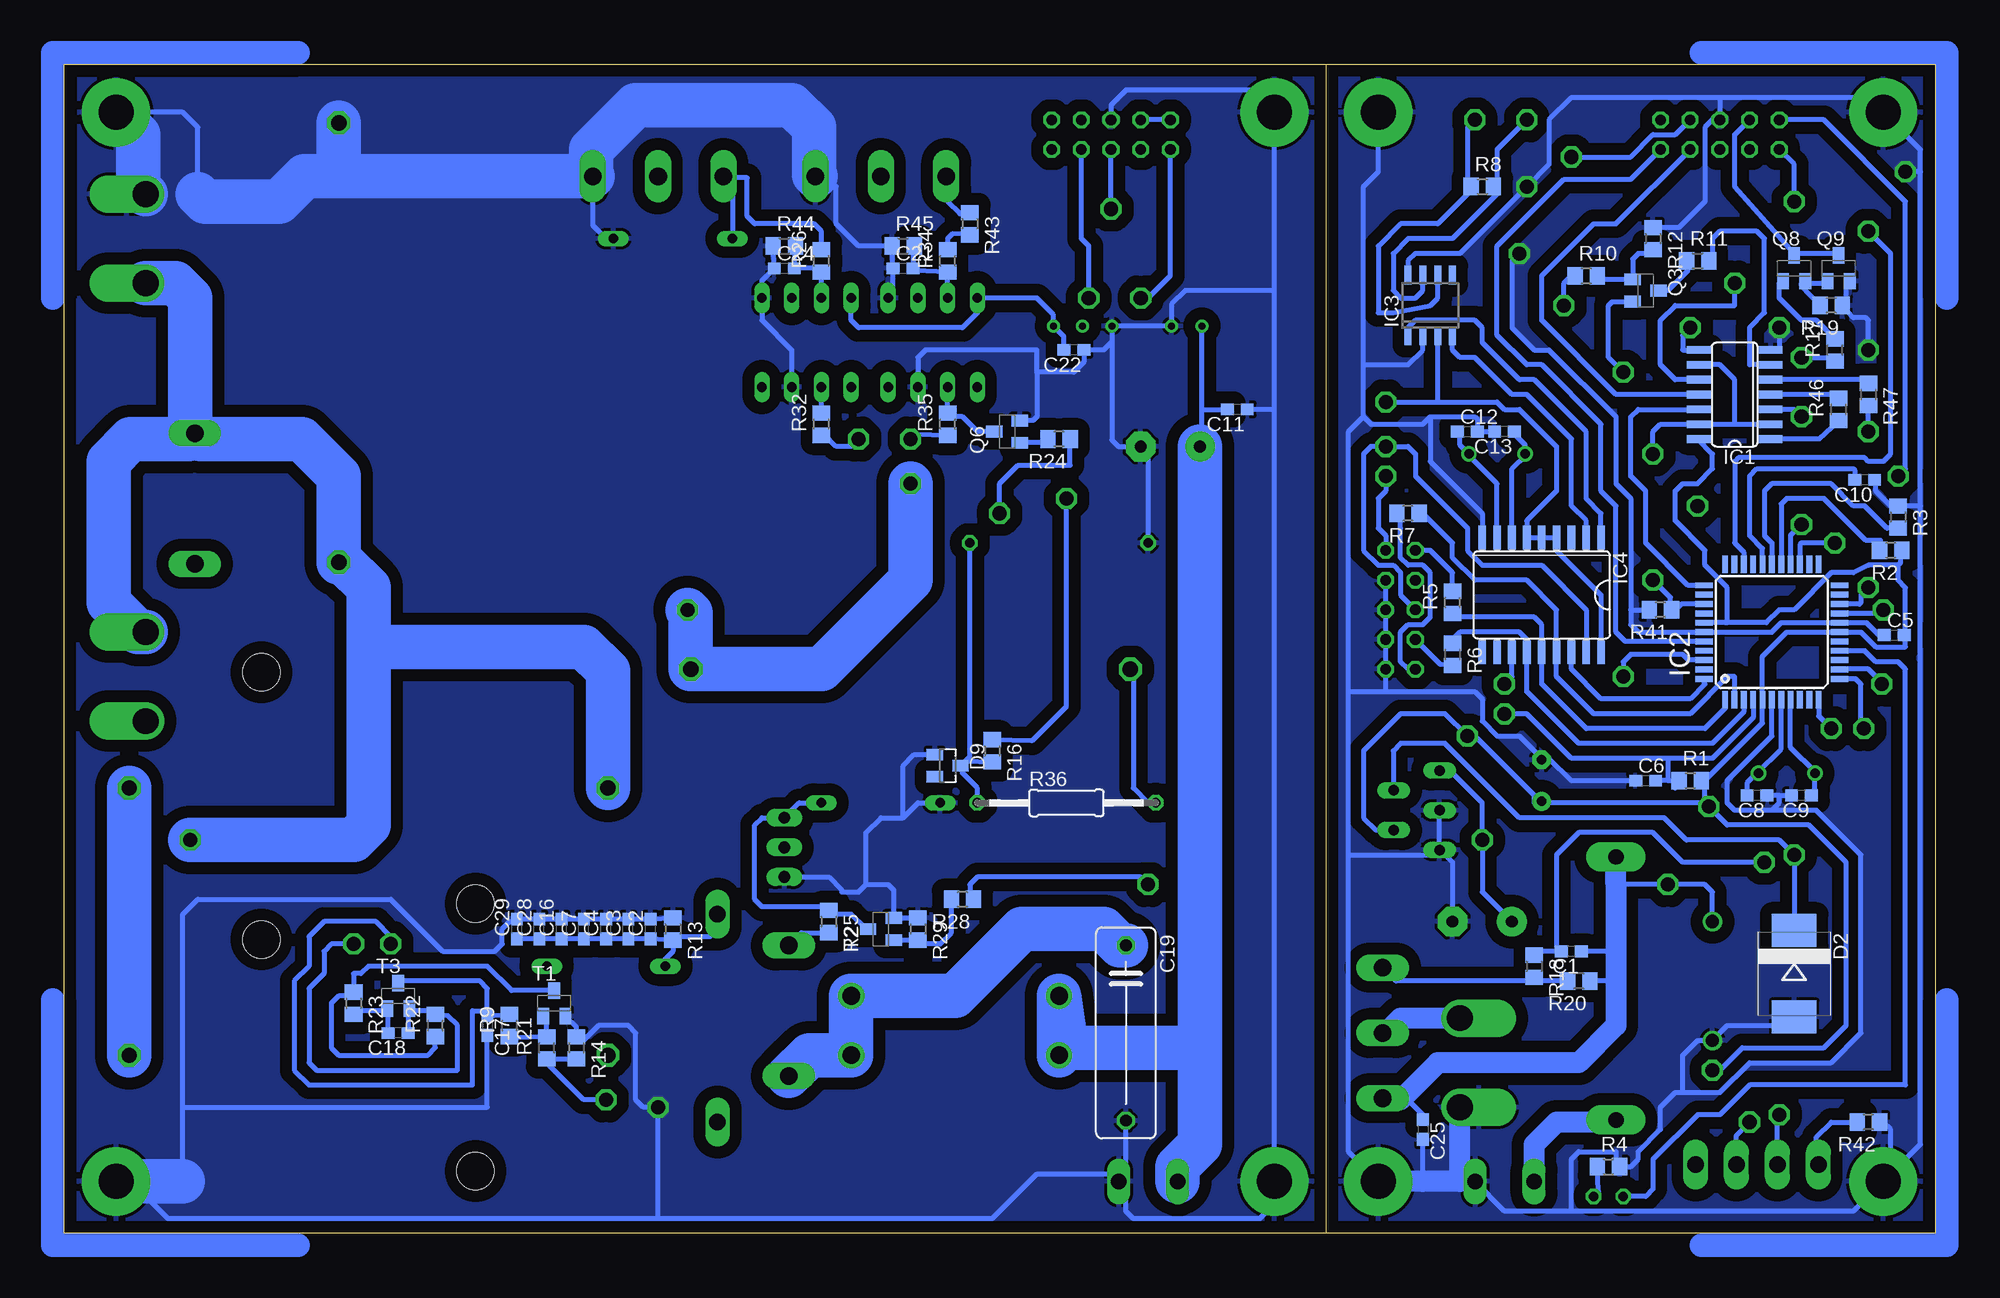
[diagram p5: board, bottom side, seen from below]

Size 160 x 100 mm. Coordinates in mm from the lower left corner, seen from the top.
Outline: 52.05,0 0,0 0,100 52.05,100
Outline: 52.05,0 52.05,100
Outline: 52.05,0 160,0 160,100 52.05,100
Copper layers (1*16): Top 0.035mm / dielectric 1.5mm / Bottom 0.035mm
Design rules "default": minimum track width 10mil, minimum drill 24mil, track to track 8mil, track to pad 8mil, pad to pad 8mil, via to via 8mil, smd to smd 8mil, copper to edge 40mil, drill to drill 8mil, minimum pad ring 10mil, minimum via ring 8mil, stop-mask expansion 4mil, vias tented up to drill 0mil, thermal gap 10mil

### Footprints (pad centres in the part's own frame; a part is rotated, then mirrored left to right if it is on the bottom)
CN-2,1 = drill 2.2 offset: >NAME 0,0
C0603 = smd 1.1 x 1: 1 -0.85,0; 2 0.85,0
E5-10,5 = drill 1.016 pad 2.54 round: + -2.54,0 | drill 1.016 pad 2.54 octagon: - 2.54,0
E3,5-10 = drill 0.813 pad 1.6 round: + -1.778,0 | drill 0.813 pad 1.6 octagon: - 1.778,0
C150-054X183 = drill 1.016 octagon: 1 -7.493,0; 2 7.493,0
C375-192X418 = drill 1.321 octagon: 1 -18.796,0; 2 18.796,0
90-4 = drill 1.422 long: 1 -5.25,5.25; 2 -1.75,5.25; 3 1.75,5.25; 4 5.25,5.25
DO41-10 = drill 1.118 round: A 5.08,0; C -5.08,0
SMC = smd 2.8 x 3.8: A 3.7,0; C -3.7,0
CB429-17 = drill 1.397 long: A 8.89,0; C -8.89,0
DO35-10 = drill 0.813 long: A 5.08,0; C -5.08,0
TO247AD = drill 1.499 long: A 5.588,-0.381; K -5.588,-0.381
DO35Z10 = drill 0.813 long: A 5.08,0; C -5.08,0
SOT23 = smd 1 x 1.4: 1 -0.95,-1.1; 2 0.95,-1.1; 3 0,1.1
SH22,5A = drill 1.321 pad 2.54 long: 1 -11.252,0; 2 11.252,0
3,0-PAD = drill 3 pad 5.842 round: B3,0 0,0
SO14 = smd 0.66 x 2.032: 1 -3.81,-3.073; 2 -2.54,-3.073; 3 -1.27,-3.073; 4 0,-3.073; 5 1.27,-3.073; 6 2.54,-3.073; 7 3.81,-3.073; 8 3.81,3.073; 9 2.54,3.073; 10 1.27,3.073; 11 0,3.073; 12 -1.27,3.073; 13 -2.54,3.073; 14 -3.81,3.073
TQFP44 = smd 1.5 x 0.5: 1 -5.8,4; 2 -5.8,3.2; 3 -5.8,2.4; 4 -5.8,1.6; 5 -5.8,0.8; 6 -5.8,0; 7 -5.8,-0.8; 8 -5.8,-1.6; 9 -5.8,-2.4; 10 -5.8,-3.2; 11 -5.8,-4; 23 5.8,-4; 24 5.8,-3.2; 25 5.8,-2.4; 26 5.8,-1.6; 27 5.8,-0.8; 28 5.8,0; 29 5.8,0.8; 30 5.8,1.6; 31 5.8,2.4; 32 5.8,3.2; 33 5.8,4 | smd 0.5 x 1.5: 12 -4,-5.8; 13 -3.2,-5.8; 14 -2.4,-5.8; 15 -1.6,-5.8; 16 -0.8,-5.8; 17 0,-5.8; 18 0.8,-5.8; 19 1.6,-5.8; 20 2.4,-5.8; 21 3.2,-5.8; 22 4,-5.8; 34 4,5.8; 35 3.2,5.8; 36 2.4,5.8; 37 1.6,5.8; 38 0.8,5.8; 39 0,5.8; 40 -0.8,5.8; 41 -1.6,5.8; 42 -2.4,5.8; 43 -3.2,5.8; 44 -4,5.8
SO8 = smd 0.6 x 1.6: 1 -1.905,-2.6; 2 -0.635,-2.6; 3 0.635,-2.6; 4 1.905,-2.6; 5 1.905,2.6; 6 0.635,2.6; 7 -0.635,2.6; 8 -1.905,2.6
SO18L = smd 0.66 x 2.032: 1 -5.08,-4.902; 2 -3.81,-4.902; 3 -2.54,-4.902; 4 -1.27,-4.902; 5 0,-4.902; 6 1.27,-4.902; 7 2.54,-4.902; 8 3.81,-4.902; 9 5.08,-4.902; 10 5.08,4.902; 11 3.81,4.902; 12 2.54,4.902; 13 1.27,4.902; 14 0,4.902; 15 -1.27,4.902; 16 -2.54,4.902; 17 -3.81,4.902; 18 -5.08,4.902
TO220-51 = drill 0.9 long: 1 -3.4,-8.4; 2 -1.7,-4.5; 3 0,-8.4; 4 1.7,-4.5; 5 3.4,-8.4
PISR = smd 3 x 3: P$1 -7.8,0; P$2 7.8,0
CHIP-LED0805 = smd 1.2 x 1.2: A 0,-1.05; C 0,1.05
LED3MM = drill 0.813 octagon: A -1.27,0; K 1.27,0
AK500/2-H = drill 1.321 long: 1 -2.515,0; 2 2.515,0
ML10 = drill 0.914 octagon: 1 -5.08,-1.27; 2 -5.08,1.27; 3 -2.54,-1.27; 4 -2.54,1.27; 5 0,-1.27; 6 0,1.27; 7 2.54,-1.27; 8 2.54,1.27; 9 5.08,-1.27; 10 5.08,1.27
HC49/S = drill 0.813 round: 1 -2.413,0; 2 2.413,0
HC49U-V = drill 0.813 round: 1 -2.413,0; 2 2.413,0
SOT23-BEC = smd 1 x 1.4: B -0.95,-1.1; C 0,1.1; E 0.95,-1.1
TO220BV = drill 1.016 long: D 0,-2.54; G -2.54,-2.54; S 2.54,-2.54
TO247BV = drill 1.499 long: D 0,-2.921; G -5.588,-2.921; S 5.588,-2.921
R0805 = smd 1.3 x 1.5: 1 -0.95,0; 2 0.95,0
HS25 = drill 1.3 octagon: 1 -20.47,0; 2 20.47,0 | hole 3.2: 9.15,9.9; -9.15,-9.9
0207/15 = drill 0.813 octagon: 1 -7.62,0; 2 7.62,0
TO247BV' = drill 1.499 long: D 0,-0.381; G -5.588,-0.381; S 5.588,-0.381
DIL08 = drill 0.813 long: 1 -1.27,-3.81; 2 1.27,-3.81; 3 3.81,-3.81; 4 6.35,-3.81; 5 6.35,3.81; 6 3.81,3.81; 7 1.27,3.81; 8 -1.27,3.81
CN-TJ6-U1-2 = drill 1.5 round: 11 -8.89,2.54; 12 -8.89,-2.54; 21 8.89,2.54; 22 8.89,-2.54
SIP = drill 0.6 round: +VIN 17.3,-4.6; +VOUT 4.6,-4.6; -VIN 14.7,-4.6; -VOUT 9.6,-4.6; OV 7.1,-4.6
AK500/2 = drill 1.321 long: 1 -2.515,0; 2 2.515,0

### Placement (x,y rotation side)
BOOSTER  40.64,18.41 180 top
C1  31.11,24.13 180 bottom
C2  109.86,26.04 90 bottom
C3  111.76,26.04 90 bottom
C4  113.67,26.04 90 bottom
C5  3.49,51.18 0 bottom
C6  24.77,38.73 0 bottom
C7  115.57,26.04 90 bottom
C8  15.24,37.47 180 bottom
C9  11.43,37.47 180 bottom
C10  6.03,64.45 180 bottom
C11  59.69,70.48 180 bottom
C12  40.01,68.58 0 bottom
C13  36.83,68.58 180 bottom
C14  38.73,26.67 0 top
C15  33.66,38.73 90 top
C16  117.47,26.04 90 bottom
C17  123.83,17.78 270 bottom
C18  131.44,17.14 180 bottom
C19  69.22,17.14 270 bottom
C20  136.53,76.2 90 top
C21  88.27,82.55 0 bottom
C22  73.66,75.56 180 bottom
C23  65.41,67.31 0 top
C24  98.42,82.55 0 bottom
C25  43.81,8.89 270 bottom
C27  87.63,48.26 0 top
C28  119.38,26.04 90 bottom
C29  121.28,26.04 90 bottom
CAN  15.24,0.64 0 top
D1  19.05,21.59 270 top
D2  12.06,22.23 270 bottom
D3  104.14,18.41 90 top
D4  113.67,22.86 180 top
D5  98.42,19.05 270 top
D6  149.22,62.87 270 top
D7  90.17,36.83 180 top
D9  84.45,40.01 270 bottom
D10  107.95,85.09 0 top
ELKO-GND  153.03,88.9 0 top
ELKO-VCC  153.03,81.28 0 top
F1  27.3,20.95 90 top
GND  40.64,10.79 180 top
H1  4.45,95.89 0 top
H2  4.45,4.45 0 top
H3  47.62,95.89 0 top
H4  47.62,4.45 0 top
H5  155.57,4.45 0 top
H6  155.57,95.89 0 top
H7  56.52,95.89 0 top
H8  56.52,4.45 0 top
IC1  17.14,71.75 90 bottom
IC2  13.97,51.44 90 bottom
IC3  43.18,79.38 0 bottom
IC4  33.66,54.61 180 bottom
IC5  50.8,36.2 270 top
IN  153.03,43.81 0 top
L1  8.89,21.59 270 top
LED1  11.43,52.7 180 top
LED2  8.89,52.7 180 top
LED3  14.61,48.9 0 top
LED4  17.14,48.9 0 top
ON  27.94,3.17 0 top
OUT  153.03,51.44 0 top
POWER  36.83,4.45 0 top
PROG  45.72,53.34 270 top
Q1  12.7,39.37 0 top
Q2  37.47,66.67 0 top
Q3  24.77,80.64 270 bottom
Q4  100.97,33.02 270 top
Q5  90.17,93.34 0 top
Q6  79.38,68.58 90 bottom
Q7  109.22,93.34 0 top
Q8  12.06,82.55 0 bottom
Q9  8.26,82.55 0 bottom
R1  20.95,38.73 0 bottom
R2  3.81,58.42 180 bottom
R3  3.17,61.28 270 bottom
R4  27.94,5.71 0 bottom
R5  41.27,53.98 90 bottom
R6  41.27,49.53 270 bottom
R7  45.09,61.59 180 bottom
R8  38.73,89.53 0 bottom
R9  121.92,17.78 90 bottom
R10  29.84,81.92 0 bottom
R11  20.32,83.19 0 bottom
R12  24.13,85.09 270 bottom
R13  107.95,26.04 270 bottom
R14  116.2,15.88 270 bottom
R16  80.64,41.27 270 bottom
R17  8.57,75.56 90 bottom
R18  34.29,22.86 270 bottom
R19  8.89,79.38 180 bottom
R20  30.48,21.59 180 bottom
R21  118.75,15.88 90 bottom
R22  128.27,17.78 90 bottom
R23  135.25,19.68 270 bottom
R24  74.93,67.94 180 bottom
R25  94.61,26.67 270 bottom
R26  95.25,83.19 90 bottom
R27  133.99,38.1 180 top
R28  83.19,28.57 180 bottom
R29  87,26.04 270 bottom
R30  11.43,48.9 90 top
R31  8.89,48.9 90 top
R32  95.25,69.22 90 bottom
R33  133.99,15.24 0 top
R34  84.45,83.19 90 bottom
R35  84.45,69.22 90 bottom
R36  74.3,36.83 0 bottom
R37  74.93,59.05 0 top
R38  14.61,52.7 270 top
R39  17.14,52.7 270 top
R40  24.77,52.07 90 top
R41  23.5,53.34 180 bottom
R42  5.71,9.53 180 bottom
R43  82.55,86.36 270 bottom
R44  98.42,84.45 0 bottom
R45  88.27,84.45 0 bottom
R46  8.26,70.48 90 bottom
R47  5.71,71.75 270 bottom
SV1  18.41,93.98 0 top
SV3  70.48,93.98 0 top
T1  118.11,19.68 0 bottom
T2  90.17,26.04 90 bottom
T3  131.44,20.32 0 bottom
U$1  FQA12P20  [TO247BV']  47.62,17.14 270 top
U$2  83.19,76.2 0 top
U$3  83.82,17.78 180 top
U$4  93.98,76.2 0 top
U$5  80.01,73.03 180 top
X2  67.31,4.45 0 top

### Tracks (layer width: path | path; a pad name or v marks a point on that pad's centre or on a via)
350V  (via drill 1.2)
  Top 0.406: 103.5,4.45 103.76,4.45
  Top 3.81: 103.19,4.76 102.87,4.45 90.17,4.45 84.45,10.16 84.45,22.86 | 103.19,4.76 104.14,5.71 D3.C | v149.22,33.66 147.96,32.38 147.96,16.51 142.88,11.43 124.46,11.43 117.47,4.45 103.5,4.45 103.19,4.76 | 84.45,22.86 76.83,30.48 76.83,33.66 75.56,34.92 73.03,34.92 68.83,39.12 C27.1 | 84.45,22.86 85.09,22.86 87,24.77 87.12,24.64 D5.K
  Bottom 0.406: R25.2 96.96,25.72 D5.K | R36.2 67.31,36.83 68.58,38.1 68.58,48.01 C27.1
  Bottom 3.81: 133.99,50.16 133.99,34.92 135.25,33.66 v149.22,33.66 | R27.2 113.52,48.11 115.57,50.16 133.99,50.16 | 133.99,50.16 133.99,55.24 136.14,57.4 C20.1 136.53,64.77 139.7,67.94 148.34,67.94 D6.K | OUT.>NAME 153.67,51.44 156.21,53.98 156.21,66.04 154.31,67.94 149.35,67.94 D6.K | ELKO-VCC.>NAME 150.5,81.28 149.22,80.01 149.22,68.83 D6.K
+5V  (via drill 1.2 pad 1.78)
  Top 0.406: 48.9,71.12 v46.99,71.12 45.72,72.39 27.3,72.39 26.67,73.03 v26.67,73.66 | PROG.2 47.62,58.42 | 9.53,13.34 L1.P$2 10.16,13.97 v19.05,13.97 | 48.9,71.12 48.9,89.53 46.99,91.44 31.75,91.44 v31.11,92.08 | 48.9,64.77 48.9,46.99 46.35,44.45 41.91,44.45 v40.01,42.55 | 48.9,64.77 48.9,71.12 | 48.9,64.77 v46.99,64.77 | 14.61,53.34 R38.1 | R39.1 16.93,53.34 14.61,53.34 | 14.61,53.34 13.97,53.34 12.7,52.07 12.7,48.26 12.06,47.62 11.85,47.62 R30.1 11.43,47.62 8.89,47.62 R31.1 8.04,48.05 6.35,46.35 6.35,45.72 5.71,45.09 4.45,45.09 3.81,44.45 3.81,42.55 4.57,41.78 5.33,41.78 5.33,35.56 18.41,35.56 v19.37,36.51
  Bottom 0.406: IC4.18 28.57,54.61 32.38,58.42 IC4.4 32.38,59.69 32.56,59.51 IC4.5 33.66,59.69 33.83,59.51 IC4.6 34.92,60.96 32.38,63.5 32.38,67.31 35.56,70.48 36.83,70.48 37.47,71.12 42.55,71.12 | 17.78,52.39 17.78,52.23 14.44,52.23 13.34,53.34 12.06,53.34 8.89,56.52 6.99,56.52 5.71,57.15 3.17,57.15 | 17.78,52.39 17.78,55.24 19.68,57.15 19.68,58.42 22.23,60.96 22.23,63.5 21.59,64.14 20.32,64.14 19.05,65.41 19.05,66.67 20.32,67.94 IC1.14 | R1.2 19.68,38.73 14.77,43.65 IC2.5 14.77,49.37 12.7,51.44 IC2.17 6.35,51.44 5.08,50.16 2.54,50.16 2.54,51.08 | R1.2 20.32,38.73 | PROG.2 46.99,59.69 47.62,60.33 47.62,62.87 46.99,63.5 v46.99,64.77 | SV1.8 22.23,93.98 24.13,93.98 26.04,92.08 v31.11,92.08 | IC5.4 47.83,34.49 48.9,35.56 48.9,41.27 45.72,44.45 41.91,44.45 v40.01,42.55 39.37,42.55 34.29,37.47 34.29,36.83 33.66,36.83 | IC2.38 17.93,52.23 17.78,52.39 | 33.66,36.83 C15.+ | v46.99,71.12 42.55,71.12 | Q3.E 27.62,79.69 27.94,79.38 27.94,74.93 v26.67,73.66 | R2.1 2.96,57.37 3.17,57.15 | R2.1 2.64,58.1 | R2.1 2.54,58.42 | R2.1 3.17,58.42 | 2.54,51.08 C5.2 | 3.17,57.15 3.17,55.88 2.54,55.24 2.54,51.08 | v19.05,13.97 18.41,13.97 16.51,15.88 9.53,15.88 7.62,17.78 7.62,31.75 10.79,34.92 17.78,34.92 v19.37,36.51 19.68,36.83 | 19.68,36.83 33.66,36.83 | 19.68,36.83 19.68,38.41 R1.2 | 42.55,71.12 IC3.3
+24V  (via drill 1.2 pad 1.78)
  Top 0.406: v38.73,33.66 37.47,34.92 24.77,34.92 | 24.77,34.92 R40.1 | 24.77,34.92 24.77,34.29 22.86,32.38 v22.86,29.84
  Bottom 0.406: IC5.1 42.4,39.52 42.55,39.37 41.27,39.37 38.73,36.83 v38.73,33.66 38.73,29.21 C14.+ | 27.3,29.84 v22.86,29.84 19.68,29.84 19.05,29.21 D1.C | 27.3,21.59 R20.1 | 27.3,24.13 C1.1 | C25.1 43.81,10.16 45.4,11.75
  Bottom 1.778: F1.2 27.3,29.84 27.3,24.13 27.3,21.59 27.3,17.78 30.48,14.61 42.55,14.61 45.4,11.75 45.72,11.43 47.12,11.43 U$1.S
ADC_250V1
  Bottom 0.406: 82.94,40.42 R16.2 80.22,40.01 | 82.94,40.42 D9.3 83.19,39.84 83.19,39.37 81.92,38.1 R36.1 | R37.2 82.55,40.81 82.94,40.42
ADC_NORM  (via drill 1.2 pad 1.78)
  Top 0.406: SV1.5 17.14,93.98 8.26,93.98 5.08,90.81 5.08,86.36 v5.71,85.72
  Bottom 0.406: v5.71,85.72 3.81,83.82 3.81,66.67 4.45,66.04 5.71,66.04 6.03,66.36 16.83,66.36 17.14,66.04 17.14,59.05 16.37,58.28 IC2.31
ADC_SUPPLY  (via drill 1.2 pad 1.78)
  Top 0.406: R40.2 24.77,55.24 v24.13,55.88
  Bottom 0.406: IC2.36 21.73,53.84 22.23,53.34 R41.1 22.64,54.4 v24.13,55.88
BOOSTER_5V  (via drill 1.2)
  Top 0.406: v135.25,24.77 135.25,36.83 133.99,38.1 121.28,38.1 118.11,41.27 105.41,41.27 104.78,40.64 81.92,40.64 81.28,41.27 81.28,52.7 84.45,55.88 84.45,57.78 85.09,58.42 107.31,58.42 120.02,71.12 120.02,76.2 123.19,79.38 123.19,95.89 121.28,97.79 74.93,97.79 73.03,95.89 SV3.8
  Bottom 0.406: v135.25,24.77 137.16,24.77 137.79,24.13 137.79,22.23 139.06,20.95 139.06,14.61 138.43,13.97 126.36,13.97 126.36,17.78 127.22,18.63 R22.2 128.69,19.05 130.32,19.05 T3.E 130.59,19.12 C18.1
BOOSTER_24V
  Bottom 0.406: 62.71,70.48 62.71,67.47 C23.+ | 62.71,70.48 U$5.+VIN | 62.71,70.48 C11.2
  Bottom 3.81: 62.87,16.51 62.87,7.62 64.8,5.69 X2.1 | 62.87,16.51 63.5,15.88 74.3,15.88 U$3.22 U$3.21 | 62.87,16.51 C23.+
BOOSTER_GND  (via drill 1.2)
  Top 0.406: v109.22,10.79 107.95,10.79 107.95,13.97 106.68,15.24 102.87,15.24 101.6,16.51 101.6,29.21 100.33,30.48 Q4.S | U$4.5 100.33,85.09 99.69,85.72 96.52,85.72 95.89,86.36 95.89,90.17 | 95.89,90.17 95.89,90.3 | U$2.5 89.53,76.83 87,74.3 U$2.3 | Q5.S 95.76,90.3 95.89,90.17
  Top 3.81: H8.B3,0 56.52,8.89 57.15,9.53 69.22,9.53
  Bottom 0.406: 148.59,88.9 148.59,94.61 149.86,95.89 H6.B3,0 155.57,98.42 | 56.52,70.48 H8.B3,0 56.52,2.54 57.78,1.27 68.58,1.27 69.22,1.91 69.22,5.05 | 56.52,70.48 56.52,80.64 | 56.52,80.64 H7.B3,0 58.42,97.79 69.22,97.79 70.48,96.52 SV3.6 | U$2.5 89.11,80.43 C21.1 R45.1 92.08,84.45 93.98,86.36 93.98,89.53 94.61,90.17 95.5,90.17 Q5.S | U$4.3 97.79,75.56 100.33,78.11 U$4.5 100.33,81.5 C24.1 R44.1 | 56.52,80.64 64.14,80.64 65.31,79.47 U$5.-VIN U$5.-VOUT | U$5.-VOUT 70.41,67.87 69.85,67.31 C23.- 67.31,66.67 R37.1 | U$5.-VOUT 70.41,76.28 71.12,75.56 C22.1 72.81,74.51 73.66,73.66 76.83,73.66 | U$2.3 87,74.93 86.36,75.56 76.83,75.56 76.83,73.66 | 139.7,90.17 139.7,90.81 | U$5.-VOUT 70.48,77.7 | Q4.S 94.61,30.48 93.52,29.38 93.52,29.21 92.08,29.21 91.44,29.84 | 88.27,35.56 90.17,35.56 91.44,34.29 91.44,29.84 | R13.1 C2.2 C3.2 C4.2 C7.2 C16.2 C28.2 C29.2 121.5,26.67 121.92,26.67 122.56,26.04 122.56,24.77 123.19,24.13 127.64,24.13 132.08,28.57 148.59,28.57 149.86,27.3 149.86,10.79 | C17.2 123.83,10.79 149.86,10.79 | T1.E 116.2,17.63 R14.1 115.99,16.51 115.57,16.51 114.3,17.78 111.76,17.78 111.12,17.14 111.12,11.43 110.49,10.79 v109.22,10.79 109.22,1.27 | 149.86,4.45 149.86,10.79 | 88.27,35.56 88.27,40.01 87.31,40.95 D9.1 85.72,41.12 | 69.22,5.05 C19.2 | 69.22,5.05 X2.2 | Q6.E 77.16,69.53 76.83,69.85 76.83,73.66 | 69.22,5.05 76.86,5.05 80.64,1.27 109.22,1.27 | 109.22,1.27 151.13,1.27 153.67,3.81 154.94,3.81 H5.B3,0 | R29.1 T2.E 89.07,29.38 89.53,29.84 91.44,29.84 | D7.A 87,36.83 88.27,35.56 | 56.52,70.48 C11.1 | Q7.S 114.81,86.23 113.67,85.09 D10.A
  Bottom 3.81: H5.B3,0 149.86,4.45 | 148.59,88.9 147.96,88.27 141.6,88.27 139.7,90.17 139.45,90.42 136.53,90.42 | 154.31,94.61 H6.B3,0 153.67,93.98 153.67,89.53 ELKO-GND.>NAME | Q5.S 95.89,90.55 95.89,94.61 97.79,96.52 111.12,96.52 114.94,92.71 114.94,90.55 Q7.S 136.53,90.42 | 136.53,90.42 C20.2
  pour Top (isolate 1.016, rank 2): 52.7,99.69 52.7,0 160.02,0 160.02,99.69
  pour Bottom (isolate 1.016, rank 3): 52.7,99.69 160.02,99.69 160.02,0 52.7,0
BOSTER_24V  (via drill 1.2)
  Top 3.81: v87.63,64.14 104.14,64.14 107.31,67.31 107.31,86.36 108.58,87.63 108.58,90.17 109.22,90.81 Q7.D | 147.32,41.91 123.83,41.91 112.39,53.34 v106.68,53.34 | D6.A 148.84,56.77 147.32,55.24 147.32,43.18 146.69,42.55 147.32,41.91 | 147.32,41.91 147.96,41.91 149.86,43.81 IN.>NAME
  Bottom 3.81: v87.63,64.14 87.63,55.88 95.25,48.26 C27.2 106.43,53.09 v106.68,53.34
CS
  Bottom 0.406: IC4.16 31.11,48.26 28.57,45.72 20.95,45.72 19.68,46.99 19.77,47.08 IC2.44
GND  (via drill 1.2 pad 1.78)
  Top 0.406: v35.56,83.82 35.56,88.9 v34.92,89.53 | v2.54,90.81 2.54,76.83 3.81,75.56 v5.71,75.56 7.62,77.47 v13.34,77.47
  Bottom 0.406: 12.06,37.47 C9.2 13.34,37.47 | 13.34,37.47 C8.1 | IC2.6 13.97,42.55 17.78,38.73 17.78,36.83 17.14,36.2 13.97,36.2 | 13.34,37.47 13.34,36.83 13.97,36.2 | R4.2 27.09,5.29 | R4.2 26.67,5.71 27.3,6.35 27.3,6.99 30.48,6.99 31.11,6.35 31.11,1.91 | 18.41,97.16 5.71,97.16 H1.B3,0 1.27,92.71 1.27,90.81 | H2.B3,0 6.99,1.91 31.11,1.91 | 31.11,1.91 36.83,1.91 39.37,4.45 | 13.97,36.2 10.16,36.2 6.35,32.38 6.35,17.14 8.89,14.61 15.88,14.61 18.41,12.06 21.59,12.06 | 18.41,97.16 SV1.6 19.05,95.25 19.68,94.61 19.68,88.27 21.91,86.04 R12.1 | R4.2 27.3,5.71 | PROG.4 PROG.6 PROG.8 PROG.10 46.99,46.35 | 13.97,75.56 IC1.7 13.34,75.56 v13.34,77.47 | 1.27,62.23 1.27,90.81 | C6.1 31.11,38.73 33.02,40.64 33.66,40.64 | 33.66,40.64 C15.- | 33.66,40.64 35.56,42.55 37.47,42.55 38.73,43.81 38.73,45.72 39.37,46.35 46.99,46.35 | IC5.3 42.4,33.16 42.55,33.02 | 26.04,53.34 26.04,62.87 27.3,64.14 27.3,69.85 33.02,75.56 34.29,75.56 36.2,77.47 36.2,83.19 v35.56,83.82 | 26.04,53.34 26.04,52.07 25.4,51.44 IC2.39 13.97,51.44 13.17,52.23 IC2.18 5.88,52.23 4.83,51.18 C5.1 | 1.27,62.23 3.07,62.23 R3.1 3.71,62.13 5.08,63.5 5.08,64.35 C10.1 | C14.- 41.27,31.75 42.55,33.02 | 1.27,90.81 v2.54,90.81 | 50.16,32.38 50.16,6.99 H4.B3,0 | 50.16,32.38 42.81,32.38 IC5.5 42.55,32.94 42.55,33.02 | 26.04,53.34 R41.2 | 6.99,81.28 7.16,81.45 Q9.E 7.45,81.45 7.62,81.28 7.62,79.38 R19.1 6.99,78.32 5.93,78.32 5.71,78.11 v5.71,75.56 | 43.18,69.85 39.37,69.85 39.16,69.64 39.16,69 38.73,68.58 | 43.18,69.85 43.81,69.22 48.26,69.22 48.9,69.85 | IC4.9 38.73,61.59 43.18,66.04 43.18,69.85 | 48.9,69.85 48.9,74.3 | 48.9,74.3 48.9,89.53 47.62,90.81 H3.B3,0
  Bottom 0.406: 50.16,32.38 50.16,46.35 | 50.16,46.35 50.16,68.58 48.9,69.85 | 50.16,46.35 46.99,46.35 | 38.73,68.58 C12.2 | 38.73,68.58 C13.2 | H2.B3,0 1.27,7.62 1.27,62.23 | R42.1 4.45,9.53 3.81,8.89 3.81,5.08 H2.B3,0 | D2.A 12.81,17.78 17.78,17.78 D1.A 20.32,16.51 21.59,15.24 21.59,12.06 | 21.59,12.06 22.23,12.06 23.5,10.79 23.5,8.89 25.4,6.99 25.4,6.35 26.04,5.71 R4.2 | 18.41,97.16 31.11,97.16 33.02,95.25 33.02,91.44 v34.92,89.53 40.64,83.82 44.45,83.82 45.09,83.19 IC3.8 | IC3.2 43.81,75.56 45.09,74.3 48.9,74.3 | 43.81,4.45 C25.2
  Bottom 1.778: 40.64,4.45 39.37,4.45 POWER.2 | 40.64,4.45 43.81,4.45 H4.B3,0 | 40.64,4.45 GND.>NAME
  pour Top (isolate 1.016, rank 2): 0,99.69 0,0 52.07,0 52.07,99.69
  pour Bottom (isolate 1.016, rank 3): 0,99.69 51.44,99.69 52.07,0 0,0
MISO
  Bottom 0.406: IC2.2 17.14,45.66 17.14,47.62 17.78,47.62 20.95,44.45 29.21,44.45 32.38,47.62 IC4.15 32.38,53.34 34.92,55.88 39.37,55.88 41.27,57.78 41.27,59.05 43.81,61.59 | 43.81,61.59 R7.1 43.81,61.59
MOSI
  Bottom 0.406: IC2.1 17.97,44.9 19.68,43.18 29.84,43.18 33.66,46.99 IC4.14 33.66,52.07 34.29,52.7 41.27,52.7 R5.1
N$1
  Bottom 0.406: IC2.15 6.02,49.84 5.08,48.9 3.17,48.9 2.54,48.26 2.54,12.7 15.88,12.7 18.41,10.16 20.32,10.16 24.13,6.35 24.13,3.81 24.77,3.17 ON.A
N$2
  Bottom 0.406: IC2.29 14.77,58.59 15.88,59.69 15.88,64.77 15.24,65.41 6.99,65.41 6.88,65.3 C10.2
N$3
  Bottom 0.406: R2.2 4.66,59.27 5.93,59.27 9.53,62.87 12.7,62.87 13.17,62.4 IC2.27
N$4
  Bottom 0.406: C9.1 10.79,37.47 10.29,37.97 Q1.1 10.16,39.37 12.37,41.58 IC2.8
N$5
  Bottom 0.406: IC2.7 13.17,41.44 15.24,39.37 | Q1.2 15.24,39.37 | C8.2 16.09,38.52 15.24,39.37
N$6
  Bottom 0.406: R5.2 41.27,56.52 43.18,58.42 PROG.1
N$7
  Bottom 0.406: R3.2 4.13,60.33 6.03,62.23 6.99,62.23 8.89,64.14 13.97,64.14 14.61,63.5 14.61,59.69 13.97,59.05 IC2.28
N$8
  Bottom 0.406: R6.2 42.33,48.68 43.18,49.53 PROG.7
N$9
  Bottom 0.406: PROG.9 45.09,48.26 45.72,48.9 45.72,51.44 45.09,52.07 43.81,52.07 43.18,52.7 43.18,56.52 43.81,57.15 45.09,57.15 45.72,57.78 45.72,59.05 45.72,60.33 45.72,61.59 R7.2
N$10
  Bottom 0.406: SV1.4 17.14,93.98 17.14,89.53 12.06,83.82 Q8.C 11.89,83.82 8.26,83.82 Q9.C
N$11
  Top 2: 20,-1 -1,-1 -1,20
N$13
  Bottom 0.406: Q9.B 9.38,81.28 10.95,81.28 Q8.E 11.29,81.28 11.43,81.28 11.43,81.06 R19.2
N$14
  Top 2: 140,-1 161,-1 161,20
N$15
  Bottom 0.406: D3.A 104.14,26.04 104.78,25.4 107.73,25.4 R13.2 | R13.2 C2.1 C3.1 C4.1 C7.1 C16.1 C28.1 C29.1 | D4.A 108.58,23.5 107.95,24.13 R13.2
N$16
  Top 2: 20,101 -1,101 -1,80
N$17
  Top 2: 161,80 161,101 140,101
N$18
  Bottom 2: 20,-1 -1,-1 -1,20
N$19
  Bottom 2: 140,-1 161,-1 161,20
N$20  (via drill 1.2 pad 1.78)
  Top 0.406: v14.61,31.75 14.61,33.66 13.97,34.29 4.45,34.29 1.27,37.47 1.27,62.87 v3.17,64.77
  Bottom 0.406: R18.1 34.29,24.13 C1.2 32.38,24.55 32.38,32.38 30.48,34.29 24.13,34.29 21.59,31.75 v14.61,31.75 | v3.17,64.77 2.54,65.41 2.54,88.27 9.53,95.25 SV1.2
N$21
  Bottom 0.406: Q8.B 13.19,81.28 13.34,81.28 13.34,80.01 11.43,78.11 10.16,78.11 9.31,77.25 R17.2
N$22
  Bottom 0.406: IC4.2 29.84,60.96 31.11,62.23 31.11,67.94 34.92,71.75 36.2,71.75 39.37,74.93 40.64,74.93 41.27,75.56 IC3.4
N$23
  Bottom 2: 20,101 -1,101 -1,80
N$24  (via drill 1.2)
  Top 0.406: v15.88,9.53 20.95,9.53 24.13,12.7 24.13,26.04 20.95,29.21 20.95,31.75 22.86,33.66 22.86,53.34 22.23,53.98 22.23,56.52 23.5,57.78 24.77,57.78 25.4,58.42 25.4,62.87 22.23,66.04 22.23,67.31 24.77,69.85 24.77,74.3 26.04,75.56 35.56,75.56 36.83,76.83 36.83,80.01 28.57,88.27 28.57,93.34 29.21,93.98 31.75,93.98 33.02,92.71 38.73,92.71 39.37,93.34 v39.37,95.25
  Bottom 0.406: CAN.3 16.99,8.41 v15.88,9.53 | v39.37,95.25 40.01,94.61 40.01,89.53 R8.1 40.01,89.22 40.01,88.9 42.55,86.36 45.72,86.36 47.62,84.45 47.62,78.74 46.35,78.74 43.18,79.38 42.55,80.01 IC3.6
N$25
  Bottom 2: 161,80 161,101 140,101
N$26
  Bottom 0.406: R20.2 34.29,21.59 | 34.29,21.59 R18.2 | U$1.G 46.1,21.59 34.29,21.59
N$27
  Bottom 0.406: R23.2 135.04,19.05 132.56,19.05 T3.B 132.29,19.12 C18.2
N$28
  Bottom 0.406: R10.2 28.68,81.59 Q3.B 25.86,83.36 25.4,83.82 24.45,83.82 R12.2
N$29
  Bottom 0.406: IC1.11 27.3,71.75 33.66,78.11 33.66,81.92 29.21,86.36 27.3,86.36 SV1.7
N$30  (via drill 1.2 pad 1.78)
  Top 0.406: L1.P$1 9.98,29.84 v12.06,32.38
  Bottom 0.406: 46.35,38.1 46.3,38.05 IC5.2 46.35,37.95 46.35,38.1 | 46.35,38.1 46.35,41.27 45.72,41.91 41.91,41.91 35.56,35.56 23.18,35.56 21.27,33.66 13.34,33.66 v12.06,32.38 D2.C
N$31
  Bottom 0.406: R4.1 28.79,3.6 ON.K
N$32
  Bottom 0.406: Q3.C 22.86,80.64 21.17,82.33 R11.1
N$33
  Bottom 0.406: IC1.6 15.88,74.3 15.88,77.47 14.61,78.74 14.61,85.09 15.24,85.72 18.41,85.72 19.05,85.09 19.05,83.61 R11.2
N$34
  Bottom 0.406: R9.1 121.72,16.73 R21.2 118.75,18.27 T1.B
N$35
  Top 3.81: Q5.D 90.17,86.36 88.9,85.09 79.38,85.09 78.11,83.82 58.42,83.82 56.52,81.92 56.52,25.4 68.45,25.4 C19.1
  Bottom 3.81: C19.1 69.72,24.64 71.12,26.04 78.11,26.04 83.82,20.32 U$3.12 U$3.11 96.27,15.24 D5.A
N$36  (via drill 1.2)
  Top 0.406: v12.06,88.27 15.88,88.27 17.14,87 v17.14,81.28
  Bottom 0.406: IC1.10 22.23,73.03 23.5,74.3 23.5,78.11 22.23,79.38 17.14,79.38 v17.14,81.28 | SV1.1 12.06,91.44 v12.06,88.27
N$37
  Bottom 0.406: T2.C 91.44,26.04 92.71,27.3 94.3,27.3 R25.1 94.94,27.94 100.33,27.94 100.97,28.57 100.97,34.92 100.33,35.56 Q4.G 97.16,36.83 D7.C
N$38
  Bottom 0.406: T2.B R29.2 86.67,24.77 85.09,24.77 84.14,25.72 R28.2
N$40  (via drill 1.2)
  Top 0.406: v11.43,69.85 v11.43,74.93
  Bottom 0.406: R17.1 8.68,74.72 8.89,74.93 v11.43,74.93 | IC1.3 12.06,70.48 v11.43,69.85
N$41
  Bottom 1.778: U$1.D 46.99,17.14 45.72,18.41 BOOSTER.>NAME
N$42  (via drill 1.2 pad 1.78)
  Top 0.406: v36.83,46.99 27.3,46.99 v26.67,47.62
  Bottom 0.406: IC2.42 21.09,49.03 21.59,49.53 26.04,49.53 26.67,48.9 v26.67,47.62 | IC4.12 36.2,47.62 v36.83,46.99
N$43
  Bottom 1.778: POWER.1 34.31,7.59 32.38,9.53 27.48,9.53 F1.1
N$44
  Top 0.406: R31.2 LED2.C
N$45
  Top 0.406: R30.2 LED1.C
N$46
  Bottom 0.406: R42.2 8.89,9.53 10.16,8.26 10.16,6.05 CAN.1
N$47
  Bottom 0.406: R43.2 84.03,85.51 84.45,85.09 R34.2
N$48  (via drill 1.2 pad 1.78)
  Top 0.406: LED1.A v11.43,60.64
  Bottom 0.406: IC2.26 12.37,59.7 v11.43,60.64
N$49  (via drill 1.2 pad 1.78)
  Top 0.406: LED2.A 8.89,58.74 v8.57,59.05
  Bottom 0.406: IC2.25 11.57,58.91 11.43,59.05 v8.57,59.05
N$50
  Bottom 0.406: IC1.4 8.68,71.75 R46.2
N$51
  Bottom 0.406: R43.1 83.4,87.21 84.45,88.27 84.45,90.3 Q5.G
N$52  (via drill 1.2)
  Top 0.406: D4.C 118.75,12.06 118.11,11.43 v113.67,11.43
  Bottom 0.406: R14.2 R21.1 118.75,14.61 115.57,11.43 v113.67,11.43
N$53
  Bottom 0.406: C13.1 36.2,68.58 35.05,67.44 Q2.1 34.92,66.67 36.2,65.41 IC4.7
N$54
  Bottom 0.406: C12.1 40.64,68.58 40.64,67.44 Q2.2 40.01,66.67 37.47,64.14 IC4.8
N$55
  Bottom 0.406: R26.2 95.25,85.72 95.89,86.36 100.97,86.36 101.6,87 101.6,90.3 103.5,90.3 Q7.G 102.87,89.66 D10.C
N$56
  Top 0.406: R33.1 111.76,15.24
  Top 1.422: 102.87,33.02 Q4.D
  Top 3.81: 102.87,33.02 111.12,33.02 113.67,30.48 113.67,15.39 R33.1
N$57
  Bottom 3.81: R33.2 R27.1
N$58
  Top 0.406: LED3.C R38.2
N$59  (via drill 1.2)
  Top 0.406: v13.34,10.16 13.34,10.79 14.61,12.06 20.95,12.06 22.23,13.34 22.23,26.04 19.68,28.57 19.68,32.38 21.59,34.29 21.59,52.7 20.95,53.34 20.95,57.15 22.86,59.05 23.5,59.05 24.13,59.69 24.13,62.23 20.95,65.41 20.95,67.31 23.5,69.85 23.5,74.93 25.4,76.83 34.29,76.83 34.92,77.47 34.92,79.38 26.67,87.63 26.67,94.61 27.3,95.25 v34.92,95.25
  Bottom 0.406: CAN.2 13.49,10.01 v13.34,10.16 | v34.92,95.25 37.47,92.71 37.47,89.53 R8.2 37.47,89.22 37.47,88.9 41.27,85.09 45.09,85.09 46.35,83.82 46.35,80.64 45.72,80.01 44.45,80.01 43.81,80.64 IC3.7
N$60
  Top 0.406: LED4.C R39.2
N$61  (via drill 1.2 pad 1.78)
  Top 0.406: LED3.A 13.12,46.35 8.26,46.35 8.26,45.34 v6.1,43.18
  Bottom 0.406: 7.43,47.44 IC2.12 6.79,47.44 6.35,46.99 6.35,43.43 v6.1,43.18
N$62  (via drill 1.2 pad 1.78)
  Top 0.406: LED4.A 17.14,46.99 13.34,43.18 v8.89,43.18
  Bottom 0.406: IC2.11 9.97,44.26 v8.89,43.18
N$65
  Bottom 0.406: R46.1 9.95,67.94 IC1.1
N$66
  Bottom 0.406: SV3.2 SV3.4
N$67
  Bottom 0.406: IC1.5 6.13,73.03 R47.1
N$68
  Bottom 0.406: R32.2 U$4.2
N$69
  Bottom 0.406: U$2.2 R35.2 84.24,69.85 83.19,69.85 81.92,68.58 Q6.C
N$70
  Bottom 0.406: U$4.8 92.71,78.11 92.08,77.47 83.19,77.47 81.92,78.74 U$2.8 76.83,80.01 75.41,78.58 U$5.+VOUT 74.51,76.72 C22.2
N$73
  Bottom 0.406: Q6.B 76.09,67.63 R24.2
N$101
  Bottom 0.406: T1.C 121.75,20.79 123.83,22.86 133.99,22.86 134.62,22.23 135.25,22.23 R23.1 135.47,20.32 136.53,20.32 137.16,19.68 137.16,15.88 136.53,15.24 128.91,15.24 128.27,15.88 R22.1
NOTABSCHALTUNG  (via drill 1.2)
  Top 0.406: v132.08,24.77 132.08,35.56 130.81,36.83 120.65,36.83 117.47,40.01 106.68,40.01 106.05,39.37 81.28,39.37 80.01,40.64 v80.01,61.59
  Bottom 0.406: T3.C 131.28,21.59 124.46,21.59 123.83,20.95 C17.1 | C17.1 R9.2 | v132.08,24.77 132.08,25.4 133.35,26.67 137.79,26.67 139.06,25.4 139.06,22.86 140.34,21.59 140.34,13.97 139.06,12.7 125.09,12.7 125.09,19.05 124.25,19.05 C17.1 | R24.1 73.98,65.72 78.42,65.72 80.01,64.14 v80.01,61.59
ON_HOLD
  Bottom 0.406: IC2.40 26.5,50.63 27.3,51.44 27.3,62.23 28.57,63.5 28.57,69.22 33.66,74.3 34.92,74.3 37.47,76.83 37.47,84.45 31.75,90.17 26.04,90.17 SV1.9
PIN1
  Bottom 0.406: IC4.1 28.57,61.59 29.84,62.87 29.84,68.58 34.29,73.03 35.56,73.03 38.73,76.2 38.73,77.47 39.37,78.11 44.45,78.11 45.09,77.47 IC3.1
POW_ON  (via drill 1.2)
  Top 0.406: v5.71,55.24 5.71,62.23 6.35,62.87 6.35,67.94 v5.71,68.58
  Bottom 0.406: IC2.20 6.49,53.84 6.35,53.98 6.35,54.61 v5.71,55.24 | v5.71,68.58 R47.2
POW_ON_INV  (via drill 1.2)
  Top 0.406: v31.75,79.38 31.11,78.74 23.5,78.74 22.86,78.11 22.86,76.2 22.23,75.56 20.95,75.56 20.32,74.93 20.32,68.58 18.41,66.67 18.41,62.87 19.05,62.23 v20.32,62.23 10.79,62.23 9.53,60.96 8.26,60.96 6.99,59.69 6.99,57.15 7.62,56.52 7.62,54.61 6.35,53.34 v4.45,53.34
  Bottom 0.406: R10.1 31.11,81.92 31.75,81.28 v31.75,79.38 | IC2.19 4.75,53.03 v4.45,53.34
PWM_BOOST  (via drill 1.2 pad 1.78)
  Top 0.406: v20.95,77.47 19.05,77.47 18.41,76.83 18.41,69.22 17.14,67.94 10.16,67.94 9.53,68.58 9.53,72.39 8.89,73.03 3.17,73.03 2.54,72.39 2.54,67.94 5.08,65.41 5.08,64.14 2.54,61.59 2.54,47.62 3.17,46.99 v4.57,46.99
  Bottom 0.406: IC1.8 21.59,75.56 21.59,76.83 v20.95,77.47 | IC2.13 8.14,48.26 5.71,48.26 5.08,47.62 5.08,46.99 v4.57,46.99
PWM_BOOST_OUT
  Bottom 0.406: U$2.7 R34.1 87.2,82.33 C21.2 R45.2
REKICK_ADC_NORM  (via drill 1.2)
  Top 0.406: v70.48,87.63 71.12,87 73.66,87 74.93,88.27 80.64,88.27 81.92,89.53 81.92,93.98 83.19,95.25 116.2,95.25 117.47,93.98 117.47,80.64 115.57,78.74 115.57,70.48 106.05,60.96 85.72,60.96 81.92,64.77 77.47,64.77 75.56,62.87 v74.3,62.87
  Bottom 0.406: R16.1 77.25,42.12 74.3,45.09 v74.3,62.87 | v70.48,87.63 SV3.5
REKICK_ON_HOLD  (via drill 1.2)
  Top 0.406: v67.31,29.84 64.77,29.84 64.14,30.48 64.14,59.05 66.04,60.96 69.85,60.96 71.75,59.05 71.75,56.52 72.39,55.88 76.2,55.88 76.83,56.52 76.83,61.59 78.74,63.5 81.28,63.5 85.09,59.69 106.68,59.69 117.47,70.48 117.47,76.83 120.02,79.38 120.02,94.61 118.11,96.52 83.19,96.52 80.64,93.98 80.64,92.71 80.01,92.08 76.2,92.08 SV3.9
  Bottom 0.406: R28.1 82.55,28.89 82.55,29.84 81.92,30.48 67.94,30.48 v67.31,29.84
REKICK_PWM  (via drill 1.2)
  Top 0.406: v87.63,67.94 73.03,67.94 67.94,73.03 v67.94,80.01
  Bottom 0.406: R35.1 87.21,68.36 v87.63,67.94 | v67.94,80.01 67.31,80.01 65.41,81.92 SV3.1
REKICK_RELEASE  (via drill 1.2)
  Top 0.406: v92.08,67.94 92.08,68.58 90.81,69.85 78.74,69.85 78.11,70.48 78.11,79.38 77.47,80.01 v72.39,80.01
  Bottom 0.406: R32.1 95.03,68.36 93.98,67.31 92.71,67.31 v92.08,67.94 | v72.39,80.01 72.39,84.45 73.03,85.09 SV3.7
RELEASE
  Bottom 0.406: IC1.12 25.4,70.48 26.04,69.85 26.04,64.77 24.77,63.5 24.77,59.05 21.14,55.44 IC2.34
RELEASE_KICK
  Bottom 0.406: R44.2 C24.2 95.47,82.55 R26.1 U$4.7
RST  (via drill 1.2, 1.2 pad 1.78)
  Top 0.406: v36.83,44.45 38.1,44.45 41.27,47.62 41.27,59.05 44.45,62.23 44.45,66.67 45.09,67.31 v46.99,67.31 46.99,68.58 44.45,71.12 29.21,71.12 27.94,69.85 27.94,67.94 26.67,66.67 v24.13,66.67
  Bottom 0.406: IC2.4 15.57,44.12 19.05,40.64 22.86,40.64 | 29.84,49.53 IC4.17 29.84,53.34 33.66,57.15 38.73,57.15 40.01,58.42 40.01,60.33 44.45,64.77 44.45,66.67 45.09,67.31 v46.99,67.31 48.26,67.31 48.9,66.67 48.9,58.42 47.62,57.15 46.35,57.15 45.72,56.52 45.72,54.61 PROG.5 | 22.23,38.1 R1.1 22.86,38.73 | v36.83,44.45 34.92,44.45 31.11,40.64 22.86,40.64 | 22.86,38.73 C6.2 | 22.86,40.64 22.86,38.73 | 20.32,74.3 IC1.9 18.41,74.3 17.14,73.03 17.14,69.22 | 17.14,69.22 IC1.13 23.5,69.22 24.13,68.58 v24.13,66.67 | 17.14,69.22 IC1.2
SCK
  Bottom 0.406: IC2.3 16.37,44.59 19.05,41.91 30.48,41.91 34.92,46.35 IC4.13 34.92,50.8 35.56,51.44 40.64,51.44 41.27,50.8 R6.1

### Text on the board
Top: Carpe Noctem | rekickNew005 | (c) 2011